# Altium project Stag12.PrjPcb (part 2 of 3)

## Sheet LOOM - HV BOX.SchDoc
size 297 x 209 mm
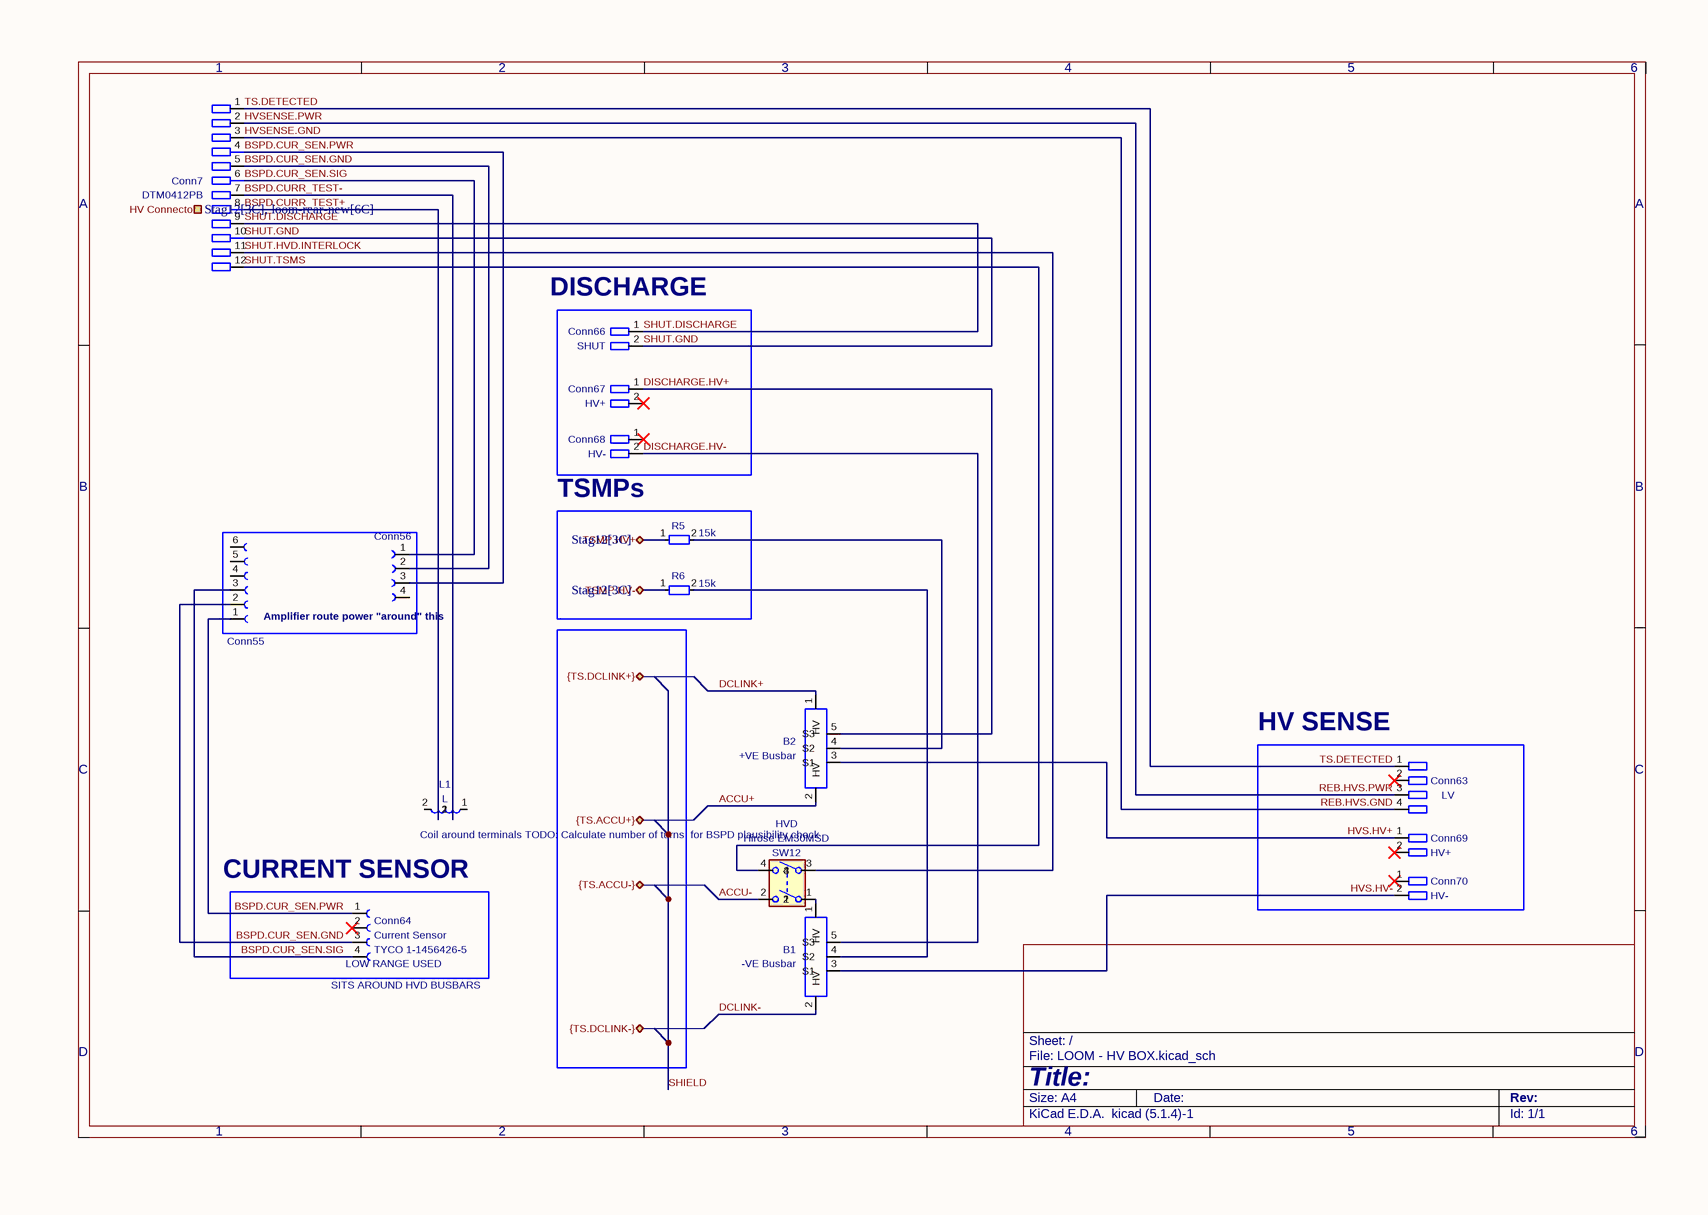
[diagram p23: LOOM - HV BOX.SchDoc]

### Parts
B1  -VE Busbar
B2  +VE Busbar
Conn7  P/N: DTM0412PB  (hidden comment: Deutsch_DTM_12P_Pin)
Conn55  Molex_3x2S_Recepticle  (value not drawn)
Conn56  Molex_2x2S_Recepticle  (value not drawn)
Conn63  Name: LV  (hidden comment: ~)
Conn64  P/N: TYCO 1-1456426-5  (hidden comment: Current Sensor)
Conn66  Name: SHUT  (hidden comment: Molex_2x1P_Horizontal_THT)
Conn67  Name: HV+  (hidden comment: Molex_2x1P_Horizontal_THT)
Conn68  Name: HV-  (hidden comment: Molex_2x1P_Horizontal_THT)
Conn69  Name: HV+  (hidden comment: Molex_2x1P_Horizontal_THT)
Conn70  Name: HV-  (hidden comment: Molex_2x1P_Horizontal_THT)
L1  L
R5  15k
R6  15k
SW12  Conn Name: HVD  (hidden comment: Hirose EM30MSD)

### Blocks framed on the sheet
Amplifier / route power "around" this: Conn55 Conn56
TSMPs: R5 R6
HV SENSE: Conn63 Conn69 Conn70
LOW RANGE USED: Conn64

### Ports
HV Connector (in, see Stag12[3C], loom-rear-new[6C]), TSMP.HV+ (bidir, see Stag12[3C]), TSMP.HV- (bidir, see Stag12[3C]), {TS.ACCU+} (bidir), {TS.ACCU-} (bidir), {TS.DCLINK+} (bidir), {TS.DCLINK-} (bidir)

### Nets
ACCU+: B2.2(HV)
ACCU-: SW12.2
BSPD.CUR_SEN.GND: Conn7.5 Conn55.2 Conn56.2 Conn64.3
BSPD.CUR_SEN.PWR: Conn7.4 Conn55.1 Conn56.3 Conn64.1
BSPD.CUR_SEN.SIG: Conn7.6 Conn55.3 Conn56.1 Conn64.4
BSPD.CURR_TEST+: Conn7.8
BSPD.CURR_TEST-: Conn7.7
DCLINK+: B2.1(HV)
DCLINK-: B1.2(HV)
DISCHARGE.HV+: B2.5(S3) Conn67.1
DISCHARGE.HV-: B1.5(S3) Conn68.2
HVS.HV+: B2.3(S1) Conn69.1
HVS.HV-: B1.3(S1) Conn70.2
HVSENSE.GND: Conn7.3 Conn63.4  [also labelled REB.HVS.GND]
HVSENSE.PWR: Conn7.2 Conn63.3  [also labelled REB.HVS.PWR]
SHUT.DISCHARGE: Conn7.9 Conn66.1
SHUT.GND: Conn7.10 Conn66.2
SHUT.HVD.INTERLOCK: Conn7.11 SW12.3
SHUT.TSMS: Conn7.12 SW12.4
TS.DETECTED: Conn7.1 Conn63.1
TSMP HV+: R5.1 ; port TSMP.HV+
TSMP HV-: R6.1 ; port TSMP.HV-
NetB1_1: B1.1(HV) SW12.1
NetB1_4: B1.4(S2) R6.2
NetB2_4: B2.4(S2) R5.2

Not connected (* = marked no-connect by the designer): Conn55 4 5 6; Conn56 4; Conn63 2*; Conn64 2*; Conn67 2*; Conn68 1*; Conn69 2*; Conn70 1*; L1 1 2

### Notes on the sheet
- (near Conn66) DISCHARGE
- Coil around terminals
  TODO: Calculate number of turns
  for BSPD plausibility check
- (near Conn64) CURRENT SENSOR
- (near Conn64) SITS AROUND HVD BUSBARS
- 1
- 2
- 3
- 4
- 5
- 6
- A
- B
- C
- D
- Title:
- File: LOOM - HV BOX.kicad_sch
- Sheet: /
- KiCad E.D.A.  kicad (5.1.4)-1
- Size: A4
- Date:
- Rev:
- Id: 1/1

### Library data of the parts
B1 B2 = Bus_Bar
  B1: Value: -VE Busbar
  B2: Value: +VE Busbar
Conn55 = Molex_3x2S_Recepticle: P/N: 43025-0600; Value: Molex_3x2S_Recepticle
Conn56 = Molex_2x2S_Recepticle: P/N: 43025-0400; Value: Molex_2x2S_Recepticle
Conn63 = Molex_2x2P_Horizontal_1: P/N: 43045-0400; Value: ~
Conn64 = Current Sensor Connector: Value: Current Sensor
Conn66-Conn70 = Molex_2x1P_Horizontal_THT: P/N: 43650-0200; Value: Molex_2x1P_Horizontal_THT
R5 R6 = R_Small: Value: 15k
SW12 = SW_DPST: Value: Hirose EM30MSD
Conn7 = Deutsch_DTM_12P_Pin: Value: Deutsch_DTM_12P_Pin
L1 = L: Value: L

## Sheet device-bps.SchDoc
size 297 x 209 mm
Used 2 times, as channels DEVICE - BPS - FRONT, DEVICE - BPS - REAR. Parts and nets are listed once, with the designators drawn on the sheet.
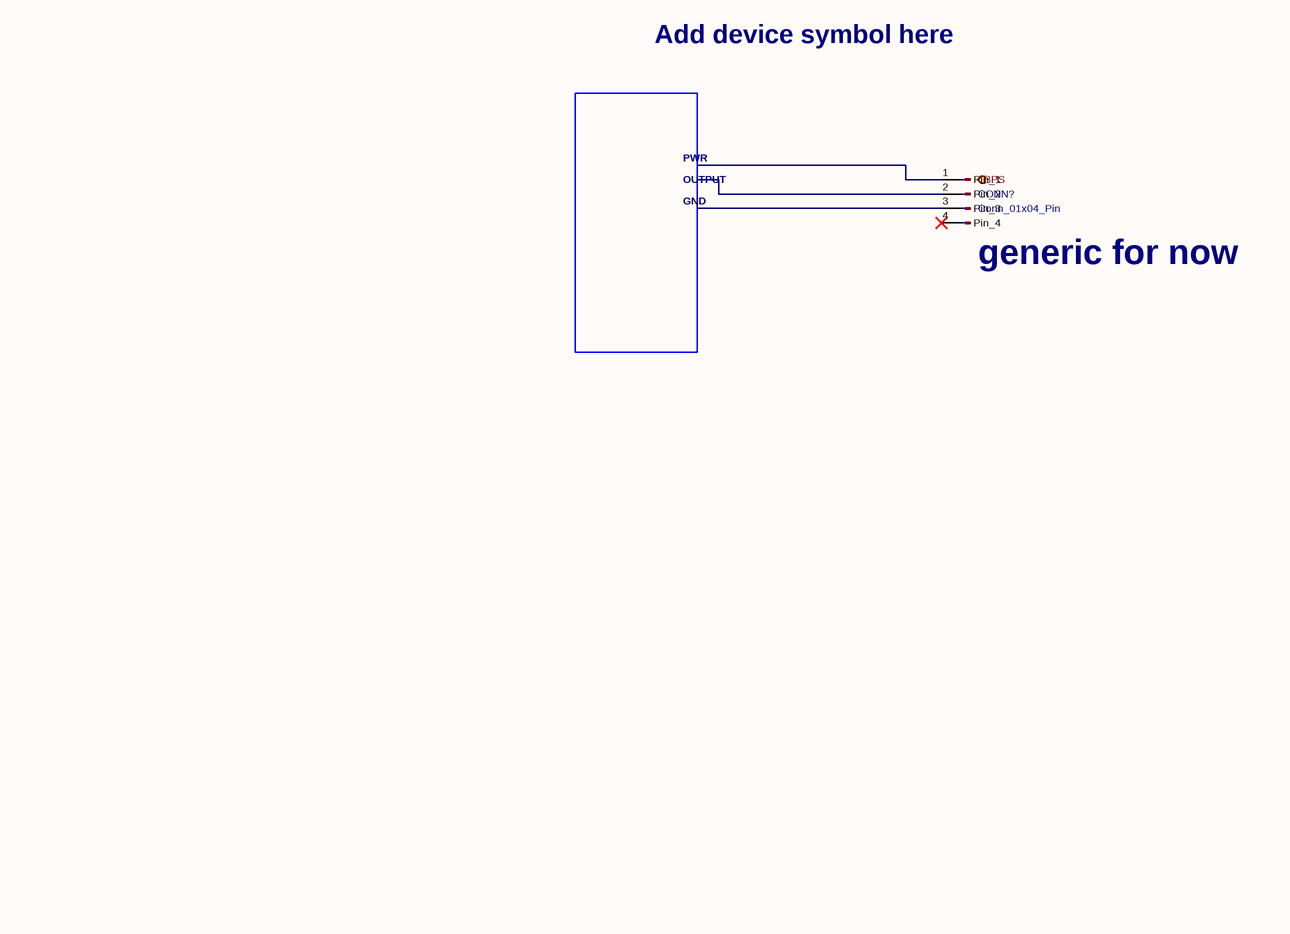
[diagram p24: device-bps.SchDoc]

### Parts
CONN?  Conn_01x04_Pin

### Ports
BPS (out)

### Nets

Not connected (* = marked no-connect by the designer): CONN? 1(Pin_1) 2(Pin_2) 3(Pin_3) 4(Pin_4)*

### Channels
DEVICE - BPS - FRONT: designators end in _DEVICE_-_BPS_-_FRONT; ports BPS=BPS_DEVICE - BPS - FRONT
DEVICE - BPS - REAR: designators end in _DEVICE_-_BPS_-_REAR; ports BPS=BPS_DEVICE - BPS - REAR

### Notes on the sheet
- Add device symbol here
- GND
- PWR
- OUTPUT
- (near CONN?) generic for now
- 1
- 2
- 3
- 4
- 5
- 6
- A
- B
- C
- D
- Title: DEVICE - BPS
- File: device-bps.kicad_sch
- Sheet: /
- KiCad E.D.A.  kicad (5.1.4)-1
- Size: A4
- Date:
- Rev:
- Id: 1/1

### Library data of the parts
CONN? = Conn_01x04_Pin: Value: Conn_01x04_Pin

## Sheet loom-front-box.SchDoc
size 840 x 594 mm
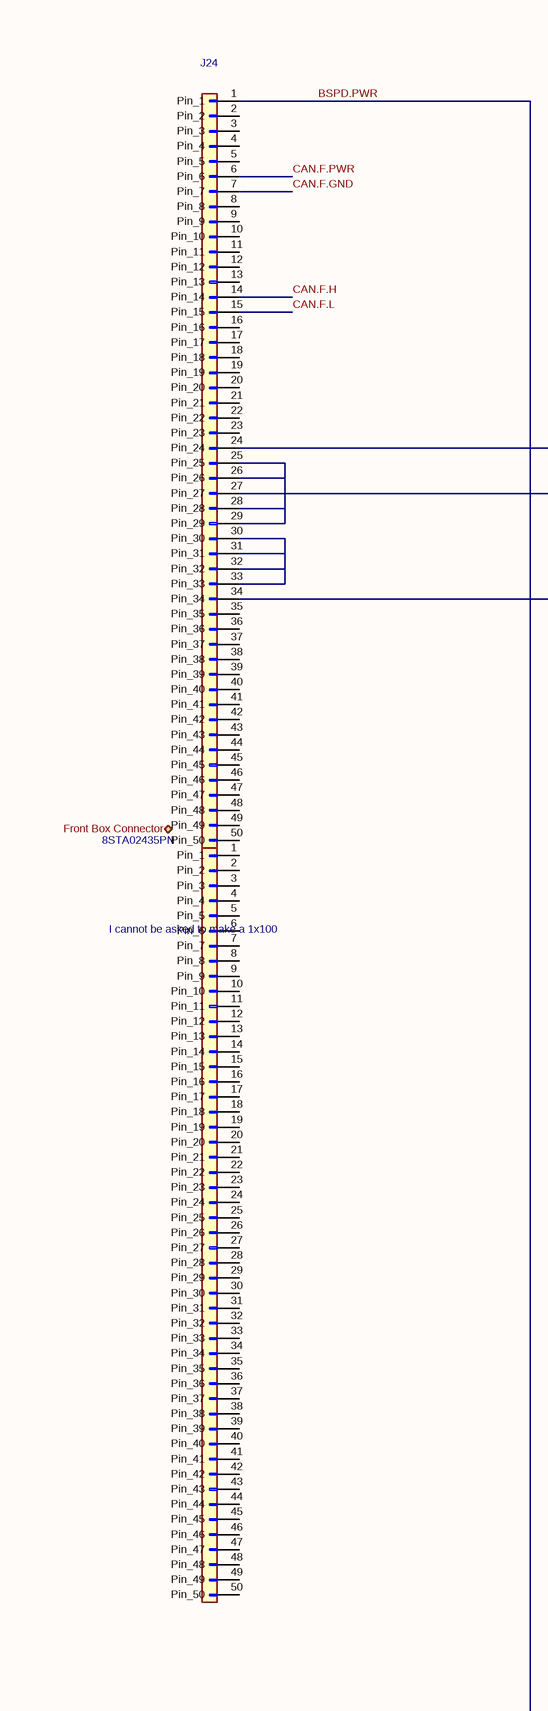
[diagram p25: loom-front-box.SchDoc, top middle]
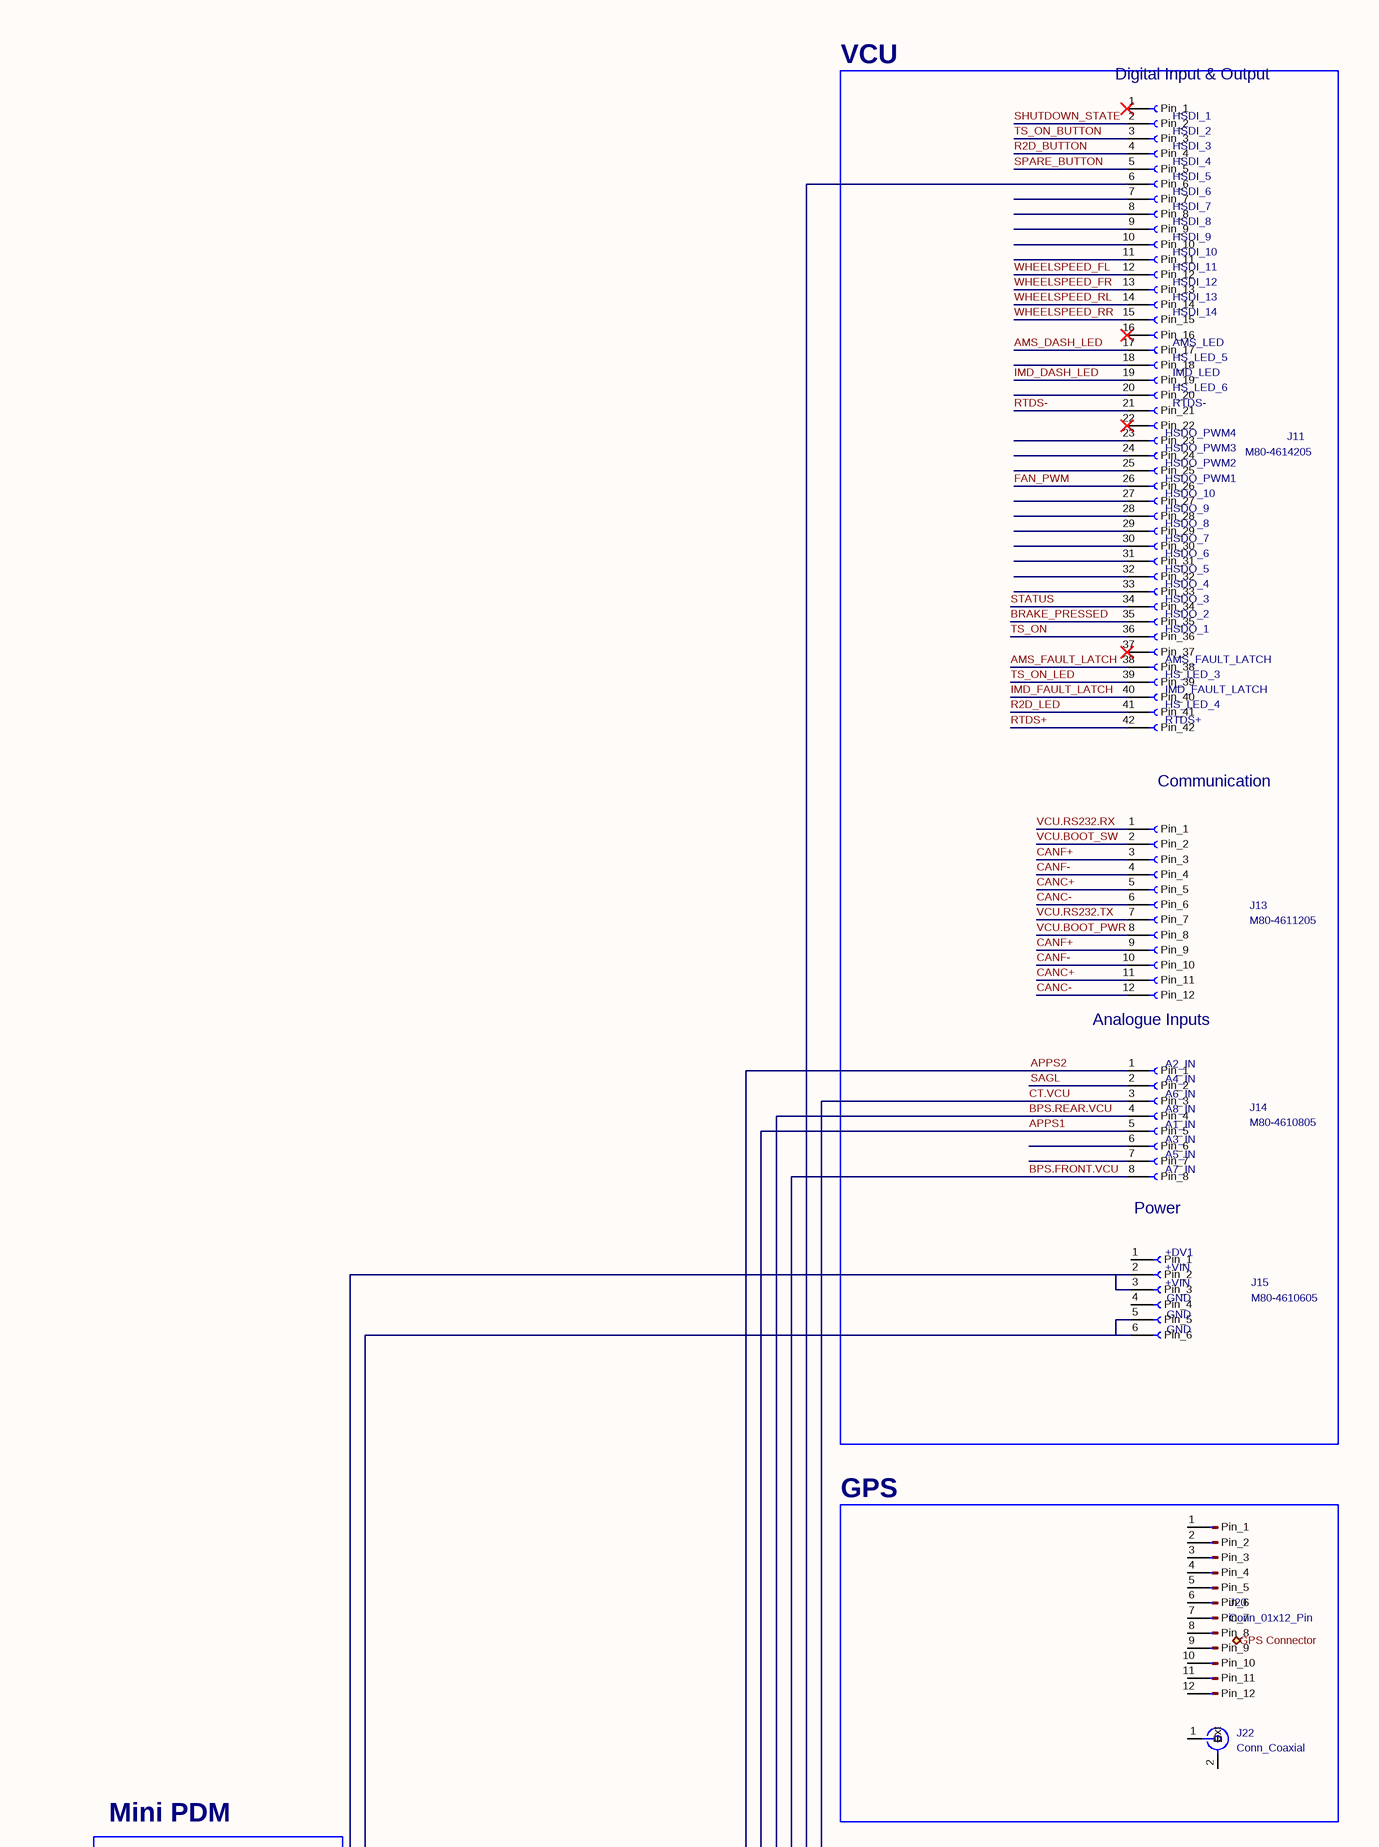
[diagram p26: loom-front-box.SchDoc, top right]
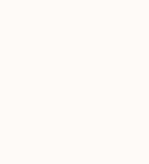
[diagram p27: loom-front-box.SchDoc, bottom left]
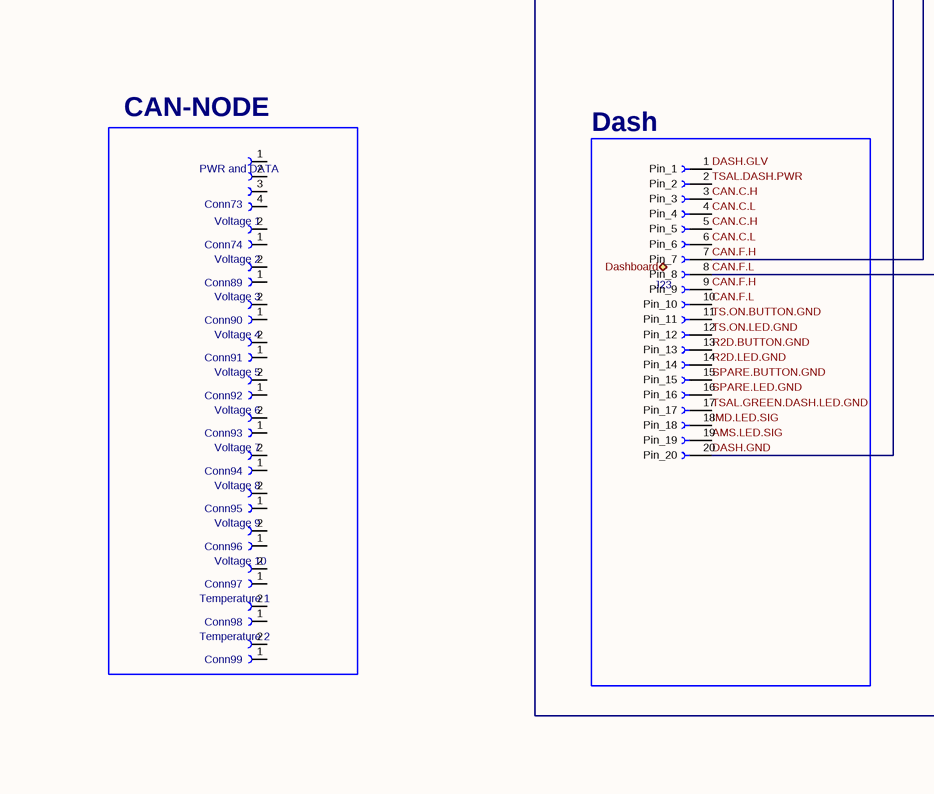
[diagram p28: loom-front-box.SchDoc, bottom middle]
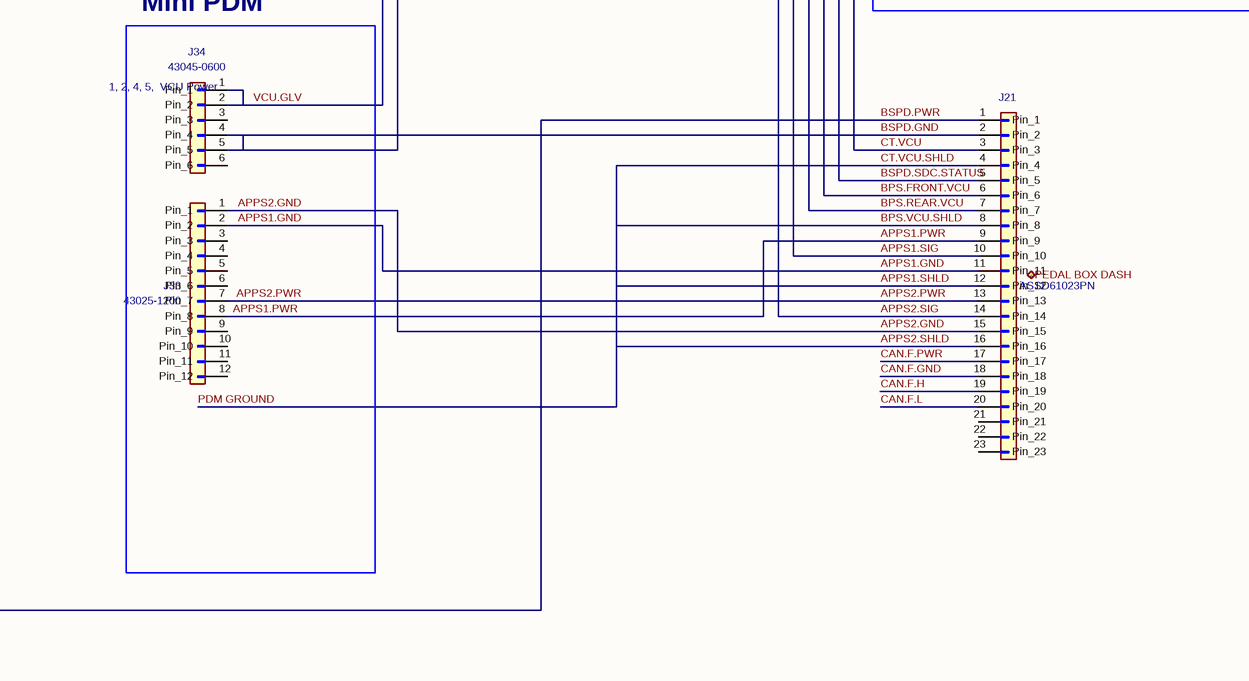
[diagram p29: loom-front-box.SchDoc, bottom right]

### Parts
(Parts that share a designator on the sheet are numbered #1, #2 ... from top to bottom, then left to right.)
Conn73  Molex_4x1S_Recepticle  (value not drawn)
Conn74#1  Molex_2x1S_Recepticle  (value not drawn)
Conn89#2  Molex_2x1S_Recepticle  (value not drawn)
Conn90#2  Molex_2x1S_Recepticle  (value not drawn)
Conn91  Molex_2x1S_Recepticle  (value not drawn)
Conn92  Molex_2x1S_Recepticle  (value not drawn)
Conn93  Molex_2x1S_Recepticle  (value not drawn)
Conn94  Molex_2x1S_Recepticle  (value not drawn)
Conn95  Molex_2x1S_Recepticle  (value not drawn)
Conn96  Molex_2x1S_Recepticle  (value not drawn)
Conn97  Molex_2x1S_Recepticle  (value not drawn)
Conn98  Molex_2x1S_Recepticle  (value not drawn)
Conn99  Molex_2x1S_Recepticle  (value not drawn)
J11  M80-4614205
J13  M80-4611205
J14  M80-4610805
J15  M80-4610605
J20  Conn_01x12_Pin
J21  ASSD61023PN
J22  Conn_Coaxial
J23  Conn_01x20_Socket  (value not drawn)
J24  8STA02435PN
J25  8STA02435PN  (value not drawn)
J33  43025-1200  [Molex_Micro-Fit_3.0_43045-1200_2x06_P3.00mm_Horizontal]
J34  43045-0600  [Molex_Micro-Fit_3.0_43045-0600_2x03_P3.00mm_Horizontal]

### Blocks framed on the sheet
VCU: J11 J13-J15
GPS: J20 J22
CAN-NODE /: Conn73 Conn74#1 Conn89#2 Conn90#2 Conn91-Conn99
Dash: J23
Mini PDM: J33 J34

### Ports
Dashboard (bidir), Front Box Connector (bidir), GPS Connector (bidir), PEDAL BOX DASH (bidir)

### Nets
AMS.LED.SIG: J23.19(Pin_19)
AMS_DASH_LED: J11.17(Pin_17)
AMS_FAULT_LATCH: J11.38(Pin_38)
APPS1: J14.5(Pin_5) J21.10(Pin_10)  [also labelled APPS1.SIG]
APPS1.GND: J21.11(Pin_11) J33.2(Pin_2)
APPS1.PWR: J21.9(Pin_9) J33.8(Pin_8)
APPS1.SHLD: J21.4(Pin_4) J21.8(Pin_8) J21.12(Pin_12) J21.16(Pin_16)  [also labelled APPS2.SHLD, BPS.VCU.SHLD, CT.VCU.SHLD, PDM GROUND]
APPS2: J14.1(Pin_1) J21.14(Pin_14)  [also labelled APPS2.SIG]
APPS2.GND: J21.15(Pin_15) J33.1(Pin_1)
APPS2.PWR: J21.13(Pin_13) J33.7(Pin_7)
BPS.FRONT.VCU: J14.8(Pin_8) J21.6(Pin_6)
BPS.REAR.VCU: J14.4(Pin_4) J21.7(Pin_7)
BRAKE_PRESSED: J11.35(Pin_35)
BSPD.GND: J15.5(Pin_5) J15.6(Pin_6) J21.2(Pin_2) J34.4(Pin_4) J34.5(Pin_5)
BSPD.PWR: J21.1(Pin_1) J24.1(Pin_1)
BSPD.SDC.STATUS: J11.6(Pin_6) J21.5(Pin_5)
CAN.C.H: J23.3(Pin_3) J23.5(Pin_5)
CAN.C.L: J23.4(Pin_4) J23.6(Pin_6)
CAN.F.GND: J21.18(Pin_18) J24.7(Pin_7)
CAN.F.H: J21.19(Pin_19) J23.7(Pin_7) J23.9(Pin_9) J24.14(Pin_14) J24.24(Pin_24)
CAN.F.L: J21.20(Pin_20) J23.8(Pin_8) J23.10(Pin_10) J24.15(Pin_15) J24.34(Pin_34)
CAN.F.PWR: J21.17(Pin_17) J24.6(Pin_6)
CANC+: J13.5(Pin_5) J13.11(Pin_11)
CANC-: J13.6(Pin_6) J13.12(Pin_12)
CANF+: J13.3(Pin_3) J13.9(Pin_9)
CANF-: J13.4(Pin_4) J13.10(Pin_10)
CT.VCU: J14.3(Pin_3) J21.3(Pin_3)
DASH.GLV: J23.1(Pin_1)
DASH.GND: J23.20(Pin_20) J24.25(Pin_25) J24.26(Pin_26) J24.27(Pin_27) J24.28(Pin_28) J24.29(Pin_29)
FAN_PWM: J11.26(Pin_26)
IMD.LED.SIG: J23.18(Pin_18)
IMD_DASH_LED: J11.19(Pin_19)
IMD_FAULT_LATCH: J11.40(Pin_40)
R2D.BUTTON.GND: J23.13(Pin_13)
R2D.LED.GND: J23.14(Pin_14)
R2D_BUTTON: J11.4(Pin_4)
R2D_LED: J11.41(Pin_41)
RTDS+: J11.42(Pin_42)
RTDS-: J11.21(Pin_21)
SAGL: J14.2(Pin_2)
SHUTDOWN_STATE: J11.2(Pin_2)
SPARE.BUTTON.GND: J23.15(Pin_15)
SPARE.LED.GND: J23.16(Pin_16)
SPARE_BUTTON: J11.5(Pin_5)
STATUS: J11.34(Pin_34)
TS.ON.BUTTON.GND: J23.11(Pin_11)
TS.ON.LED.GND: J23.12(Pin_12)
TS_ON: J11.36(Pin_36)
TS_ON_BUTTON: J11.3(Pin_3)
TS_ON_LED: J11.39(Pin_39)
TSAL.DASH.PWR: J23.2(Pin_2)
TSAL.GREEN.DASH.LED.GND: J23.17(Pin_17)
VCU.BOOT_PWR: J13.8(Pin_8)
VCU.BOOT_SW: J13.2(Pin_2)
VCU.GLV: J15.2(Pin_2) J15.3(Pin_3) J34.1(Pin_1) J34.2(Pin_2)
VCU.RS232.RX: J13.1(Pin_1)
VCU.RS232.TX: J13.7(Pin_7)
WHEELSPEED_FL: J11.12(Pin_12)
WHEELSPEED_FR: J11.13(Pin_13)
WHEELSPEED_RL: J11.14(Pin_14)
WHEELSPEED_RR: J11.15(Pin_15)
NetJ24_30: J24.30(Pin_30) J24.31(Pin_31) J24.32(Pin_32) J24.33(Pin_33)

Not connected (* = marked no-connect by the designer): Conn73 1 2 3 4; Conn74#1 1 2; Conn89#2 1 2; Conn90#2 1 2; Conn91 1 2; Conn92 1 2; Conn93 1 2; Conn94 1 2; Conn95 1 2; Conn96 1 2; Conn97 1 2; Conn98 1 2; Conn99 1 2; J11 1(Pin_1)* 7(Pin_7) 8(Pin_8) 9(Pin_9) 10(Pin_10) 11(Pin_11) 16(Pin_16)* 18(Pin_18) 20(Pin_20) 22(Pin_22)* 23(Pin_23) 24(Pin_24) 25(Pin_25) 27(Pin_27) 28(Pin_28) 29(Pin_29) 30(Pin_30) 31(Pin_31) 32(Pin_32) 33(Pin_33) 37(Pin_37)*; J14 6(Pin_6) 7(Pin_7); J15 1(Pin_1) 4(Pin_4); J20 1(Pin_1) 2(Pin_2) 3(Pin_3) 4(Pin_4) 5(Pin_5) 6(Pin_6) 7(Pin_7) 8(Pin_8) 9(Pin_9) 10(Pin_10) 11(Pin_11) 12(Pin_12); J21 21(Pin_21) 22(Pin_22) 23(Pin_23); J22 1(In) 2(Ext); J24 2(Pin_2) 3(Pin_3) 4(Pin_4) 5(Pin_5) 8(Pin_8) 9(Pin_9) 10(Pin_10) 11(Pin_11) 12(Pin_12) 13(Pin_13) 16(Pin_16) 17(Pin_17) 18(Pin_18) 19(Pin_19) 20(Pin_20) 21(Pin_21) 22(Pin_22) 23(Pin_23) 35(Pin_35) 36(Pin_36) 37(Pin_37) 38(Pin_38) 39(Pin_39) 40(Pin_40) 41(Pin_41) 42(Pin_42) 43(Pin_43) 44(Pin_44) 45(Pin_45) 46(Pin_46) 47(Pin_47) 48(Pin_48) 49(Pin_49) 50(Pin_50); J25 1(Pin_1) 2(Pin_2) 3(Pin_3) 4(Pin_4) 5(Pin_5) 6(Pin_6) 7(Pin_7) 8(Pin_8) 9(Pin_9) 10(Pin_10) 11(Pin_11) 12(Pin_12) 13(Pin_13) 14(Pin_14) 15(Pin_15) 16(Pin_16) 17(Pin_17) 18(Pin_18) 19(Pin_19) 20(Pin_20) 21(Pin_21) 22(Pin_22) 23(Pin_23) 24(Pin_24) 25(Pin_25) 26(Pin_26) 27(Pin_27) 28(Pin_28) 29(Pin_29) 30(Pin_30) 31(Pin_31) 32(Pin_32) 33(Pin_33) 34(Pin_34) 35(Pin_35) 36(Pin_36) 37(Pin_37) 38(Pin_38) 39(Pin_39) 40(Pin_40) 41(Pin_41) 42(Pin_42) 43(Pin_43) 44(Pin_44) 45(Pin_45) 46(Pin_46) 47(Pin_47) 48(Pin_48) 49(Pin_49) 50(Pin_50); J33 3(Pin_3) 4(Pin_4) 5(Pin_5) 6(Pin_6) 9(Pin_9) 10(Pin_10) 11(Pin_11) 12(Pin_12); J34 3(Pin_3) 6(Pin_6)

### Notes on the sheet
- (near J11) Digital Input & Output
- (near J11) HSDI_4
- (near J11) HSDI_3
- (near J11) HSDI_2
- (near J11) HSDI_1
- (near J11) HSDI_8
- (near J11) HSDI_5
- (near J11) HSDI_6
- (near J11) HSDI_7
- (near J11) HSDI_9
- (near J11) HSDI_13
- (near J11) HSDI_14
- (near J11) HSDI_10
- (near J11) HSDI_11
- (near J11) HSDI_12
- (near J11) IMD_LED
- (near J11) HS_LED_6
- (near J11) AMS_LED
- (near J11) HS_LED_5
- (near J11) HSDO_PWM4
- (near J11) HSDO_PWM3
- (near J11) HSDO_PWM2
- (near J11) RTDS-
- (near J11) HSDO_PWM1
- (near J11) HSDO_8
- (near J11) HSDO_7
- (near J11) HSDO_9
- (near J11) HSDO_10
- (near J11) HSDO_5
- (near J11) HSDO_4
- (near J11) HSDO_2
- (near J11) HSDO_6
- (near J11) HSDO_3
- (near J11) AMS_FAULT_LATCH
- (near J11) HS_LED_3
- (near J11) HSDO_1
- (near J11) IMD_FAULT_LATCH
- (near J11) HS_LED_4
- (near J11) RTDS+
- Communication
- (near J25) I cannot be asked
  to make a 1x100
- (near J13) Analogue Inputs
- (near J14) A2_IN
- (near J14) A4_IN
- (near J14) A1_IN
- (near J14) A6_IN
- (near J14) A3_IN
- (near J14) A8_IN
- Power
- (near J14) A5_IN
- (near J14) A7_IN
- (near J15) +VIN
- (near J15) +DV1
- (near J15) GND
- (near Conn73) PWR and DATA
- (near J34) 1, 2,
  4, 5,
  VCU Power
- (near Conn74#1) Voltage 1
- (near Conn89#2) Voltage 2
- (near Conn90#2) Voltage 3
- (near Conn91) Voltage 4
- (near Conn92) Voltage 5
- (near Conn93) Voltage 6
- (near Conn94) Voltage 7
- (near Conn95) Voltage 8
- (near Conn97) Voltage 10
- (near Conn96) Voltage 9
- (near Conn98) Temperature 1
- (near Conn99) Temperature 2
- 1
- 2
- 3
- 4
- 5
- 6
- 7
- 8
- 9
- 10
- 11
- 12
- 13
- 14
- 15
- 16
- A
- B
- C
- D
- E
- F
- G
- H
- I
- J
- K
- Title: Front Box
- File: loom-front-box.kicad_sch
- Sheet: /
- KiCad E.D.A.  kicad (5.1.4)-1
- Size: A1
- Date:
- Rev:
- Id: 1/1

### Library data of the parts
Conn73 = Molex_4x1S_Recepticle: P/N: 43645-0400; Value: Molex_4x1S_Recepticle
Conn74#1 Conn89#2 Conn90#2 Conn91-Conn99 = Molex_2x1S_Recepticle: P/N: 43645-0200; Value: Molex_2x1S_Recepticle
J11 = Conn_01x42_Socket: Description: "Generic connector, single row, 01x42, script generated"; Value: M80-4614205
J13 = Conn_01x12_Socket: Description: Generic connector, single row, 01x12, script generated; Value: M80-4611205
J14 = Conn_01x08_Socket: Description: Generic connector, single row, 01x08, script generated; Value: M80-4610805
J15 = Conn_01x06_Socket: Description: Generic connector, single row, 01x06, script generated; Value: M80-4610605
J20 = Conn_01x12_Pin: Description: Generic connector, single row, 01x12, script generated; Value: Conn_01x12_Pin
J21 = Conn_01x23: Description: Generic connector, single row, 01x23, script generated (kicad-library-utils/schlib/autogen/connector/); Value: ASSD61023PN
J22 = Conn_Coaxial: Description: coaxial connector (BNC, SMA, SMB, SMC, Cinch/RCA, LEMO, ...); Value: Conn_Coaxial
J23 = Conn_01x20_Socket: Description: Generic connector, single row, 01x20, script generated; Value: Conn_01x20_Socket
J24 J25 = Conn_01x50: Description: "Generic connector, single row, 01x50, script generated"; Value: 8STA02435PN
J33 = Conn_01x12: Description: Generic connector, single row, 01x12, script generated (kicad-library-utils/schlib/autogen/connector/); To Order: INV; Value: 43025-1200; Footprint: Connector_Molex:Molex_Micro-Fit_3.0_43045-1200_2x06_P3.00mm_Horizontal
J34 = Conn_01x06: Description: Generic connector, single row, 01x06, script generated (kicad-library-utils/schlib/autogen/connector/); To Order: INV; Value: 43045-0600; Footprint: Connector_Molex:Molex_Micro-Fit_3.0_43045-0600_2x03_P3.00mm_Horizontal

## Sheet loom-side-panel-right.SchDoc
size 297 x 209 mm
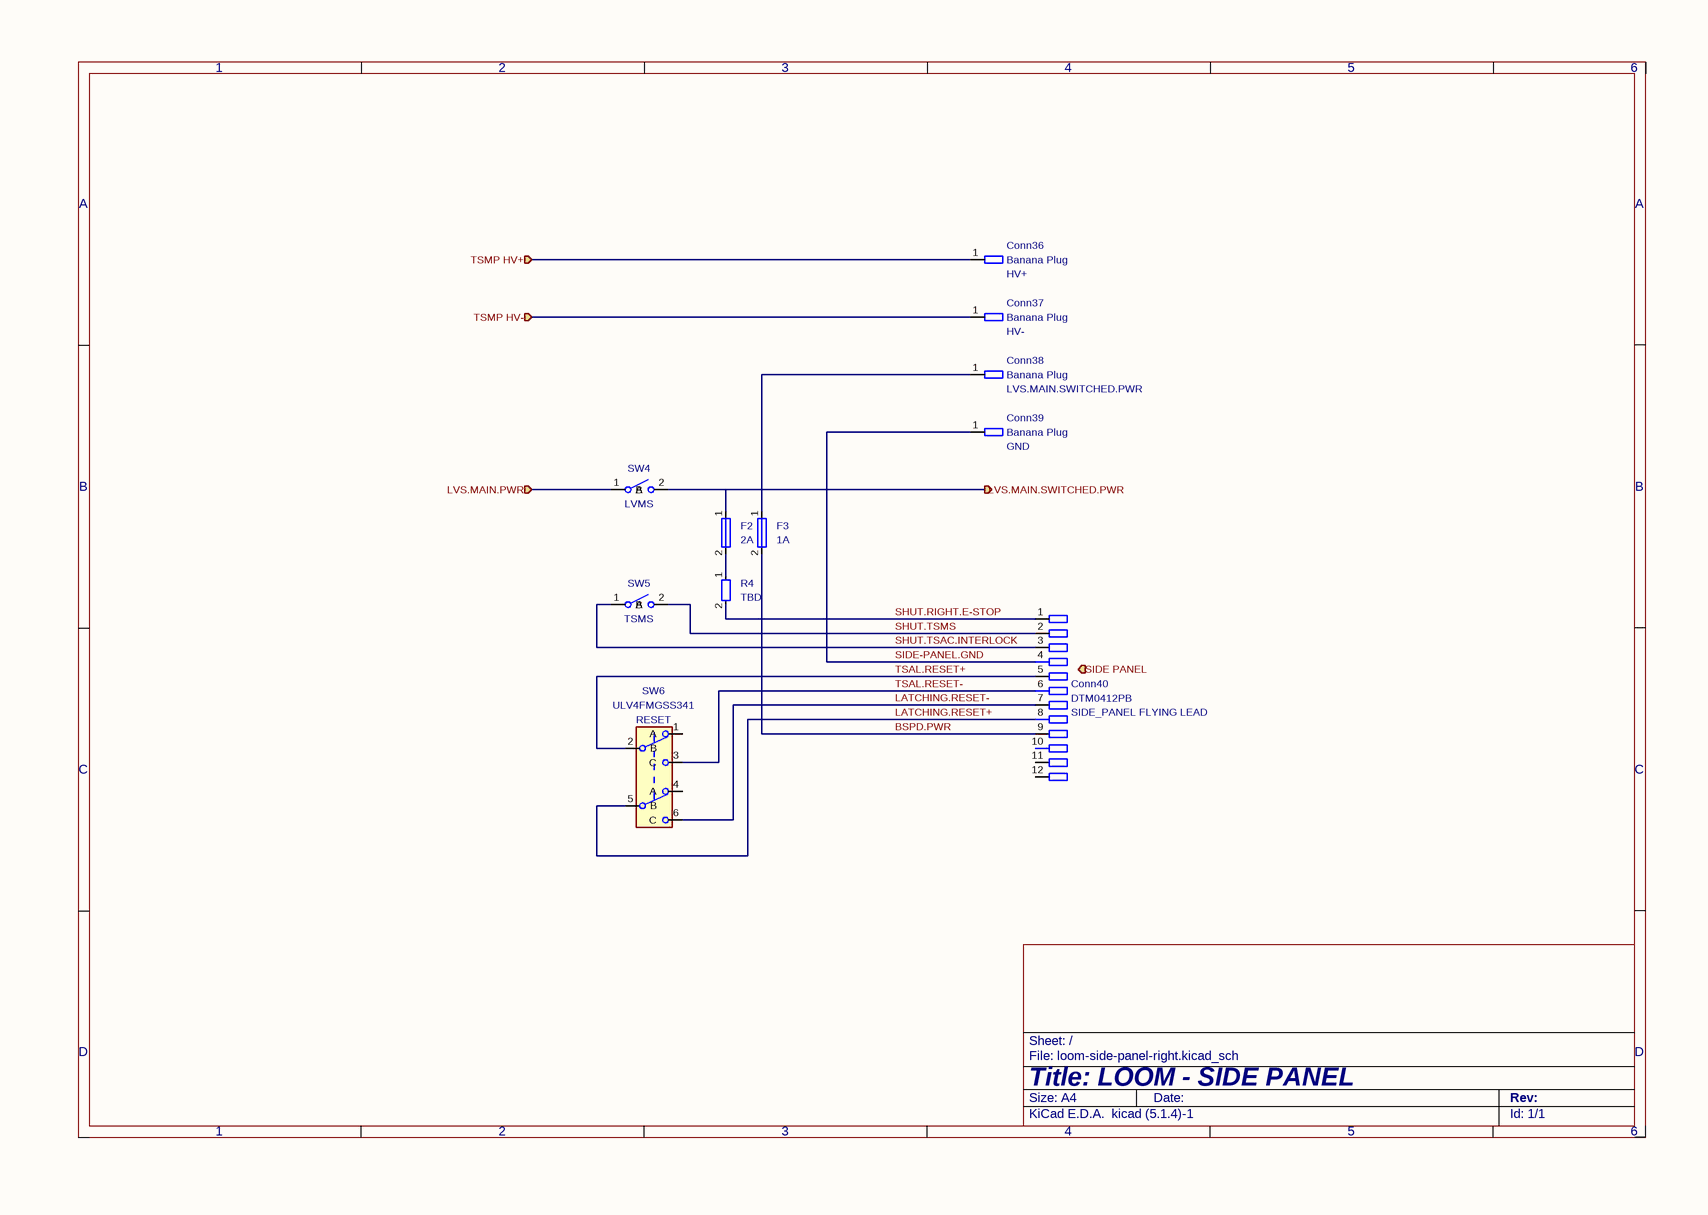
[diagram p30: loom-side-panel-right.SchDoc]

### Parts
(Parts that share a designator on the sheet are numbered #1, #2 ... from top to bottom, then left to right.)
Conn36#1  Connection Type: HV+  (hidden comment: Banana Plug)
Conn37#1  Connection Type: HV-  (hidden comment: Banana Plug)
Conn38#1  Connection Type: LVS.MAIN.SWITCHED.PWR  (hidden comment: Banana Plug)
Conn39#1  Connection Type: GND  (hidden comment: Banana Plug)
Conn40#1  P/N: DTM0412PB  Conn Name: SIDE_PANEL FLYING LEAD  (hidden comment: Deutsch_DTM_12P_Pin)
F2  2A
F3  1A
R4#1  TBD
SW4#1  LVMS
SW5#1  TSMS
SW6#1  Conn Name: RESET  (hidden comment: ULV4FMGSS341)

### Ports
LVS.MAIN.PWR (in), LVS.MAIN.SWITCHED.PWR (out), SIDE PANEL (in), TSMP HV+ (in), TSMP HV- (in)

### Nets
BSPD.PWR: Conn40#1.9 F3.2
GLV.LVMS+: SW4#1.1(A) ; port LVS.MAIN.PWR
LATCHING.RESET+: Conn40#1.8 SW6#1.5(B)
LATCHING.RESET-: Conn40#1.7 SW6#1.6(C)
LVS.MAIN.SWITCHED.EXC: Conn38#1.1 F2.1 F3.1 SW4#1.2(B) ; port LVS.MAIN.SWITCHED.PWR
SHUT.RIGHT.E-STOP: Conn40#1.1 R4#1.2
SHUT.TSAC.INTERLOCK: Conn40#1.3 SW5#1.1(A)
SHUT.TSMS: Conn40#1.2 SW5#1.2(B)
SIDE-PANEL.GND: Conn39#1.1 Conn40#1.4
TSAL.RESET+: Conn40#1.5 SW6#1.2(B)
TSAL.RESET-: Conn40#1.6 SW6#1.3(C)
TSMP HV+: Conn36#1.1 ; port TSMP HV+
TSMP HV-: Conn37#1.1 ; port TSMP HV-
NetF2_2: F2.2 R4#1.1

Not connected (* = marked no-connect by the designer): Conn40#1 10 11 12; SW6#1 1(A) 4(A)

### Notes on the sheet
- 1
- 2
- 3
- 4
- 5
- 6
- A
- B
- C
- D
- Title: LOOM - SIDE PANEL
- File: loom-side-panel-right.kicad_sch
- Sheet: /
- KiCad E.D.A.  kicad (5.1.4)-1
- Size: A4
- Date:
- Rev:
- Id: 1/1

### Library data of the parts
F2 F3 = Fuse
  F2: Value: 2A
  F3: Value: 1A
R4#1 = R_Small: Value: TBD
SW4#1 SW5#1 = SW_SPST
  SW4#1: Value: LVMS
  SW5#1: Value: TSMS
SW6#1 = SW_Push_DPDT: Value: ULV4FMGSS341
Conn36#1 Conn37#1 Conn38#1 Conn39#1 = Banana Plug: Value: Banana Plug
Conn40#1 = Deutsch_DTM_12P_Pin: Value: Deutsch_DTM_12P_Pin

## Sheet device-bspd.SchDoc
size 297 x 209 mm
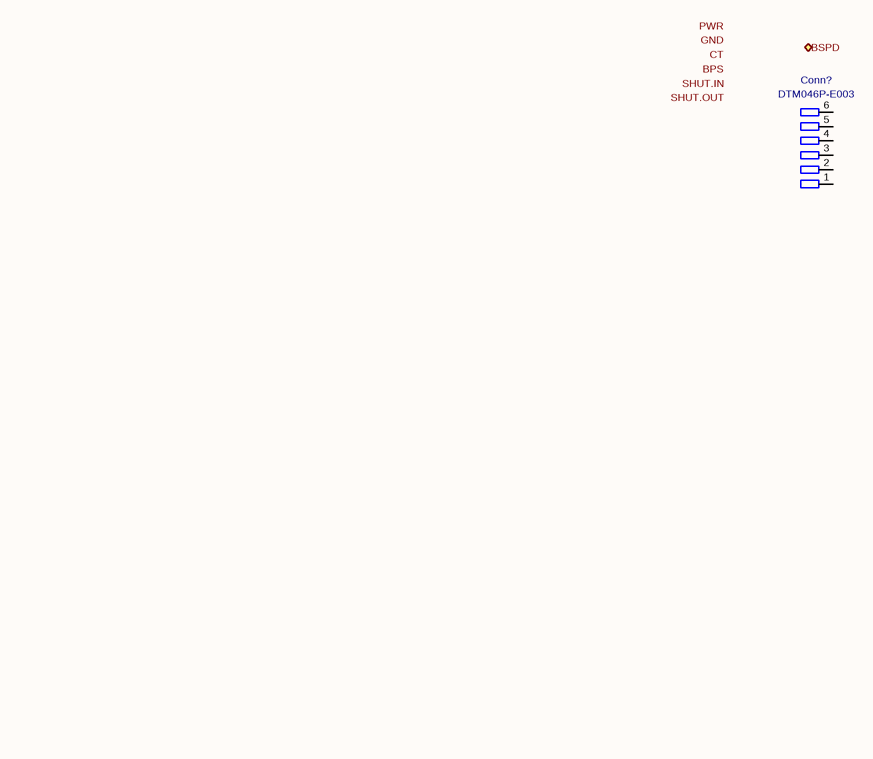
[diagram p31: device-bspd.SchDoc]

### Parts
(Parts that share a designator on the sheet are numbered #1, #2 ... from top to bottom, then left to right.)
Conn?#10  P/N: DTM046P-E003  (hidden comment: Deutsch_DTM_6P_Pin)

### Ports
BSPD (bidir)

### Nets

Not connected (* = marked no-connect by the designer): Conn?#10 1 2 3 4 5 6

### Notes on the sheet
- Labels drawn without touching a wire or pin: BPS, CT, GND, PWR, SHUT.IN, SHUT.OUT
- 1
- 2
- 3
- 4
- 5
- 6
- A
- B
- C
- D
- Title: DEVICE - BSPD
- File: device-bspd.kicad_sch
- Sheet: /
- KiCad E.D.A.  kicad (5.1.4)-1
- Size: A4
- Date:
- Rev:
- Id: 1/1

### Library data of the parts
Conn?#10 = Deutsch_DTM_6P_Pin: Value: Deutsch_DTM_6P_Pin

## Sheet device-ground-box.SchDoc
size 297 x 209 mm
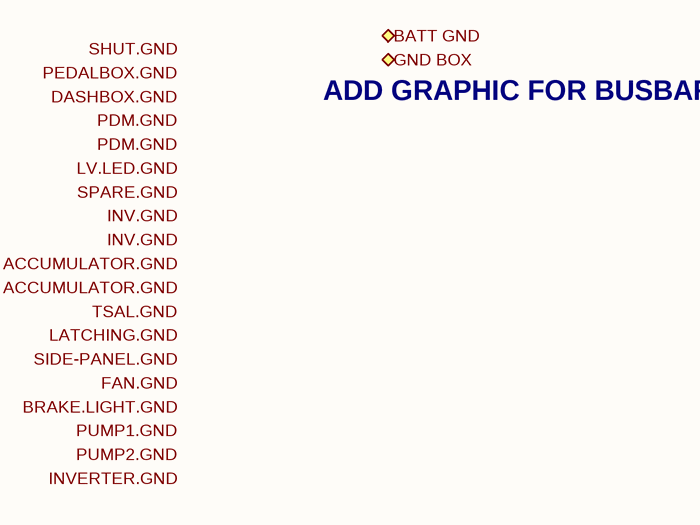
[diagram p32: device-ground-box.SchDoc]

### Ports
BATT GND (bidir), GND BOX (bidir)

### Notes on the sheet
- ADD GRAPHIC FOR BUSBAR
- Labels drawn without touching a wire or pin: ACCUMULATOR.GND, BRAKE.LIGHT.GND, DASHBOX.GND, FAN.GND, INV.GND, INVERTER.GND, LATCHING.GND, LV.LED.GND, PDM.GND, PEDALBOX.GND, PUMP1.GND, PUMP2.GND, SHUT.GND, SIDE-PANEL.GND, SPARE.GND, TSAL.GND
- 1
- 2
- 3
- 4
- 5
- 6
- A
- B
- C
- D
- Title: DEVICE - GROUND BOX
- File: device-ground-box.kicad_sch
- Sheet: /
- KiCad E.D.A.  kicad (5.1.4)-1
- Size: A4
- Date:
- Rev:
- Id: 1/1

## Sheet device-motor.SchDoc
size 297 x 209 mm
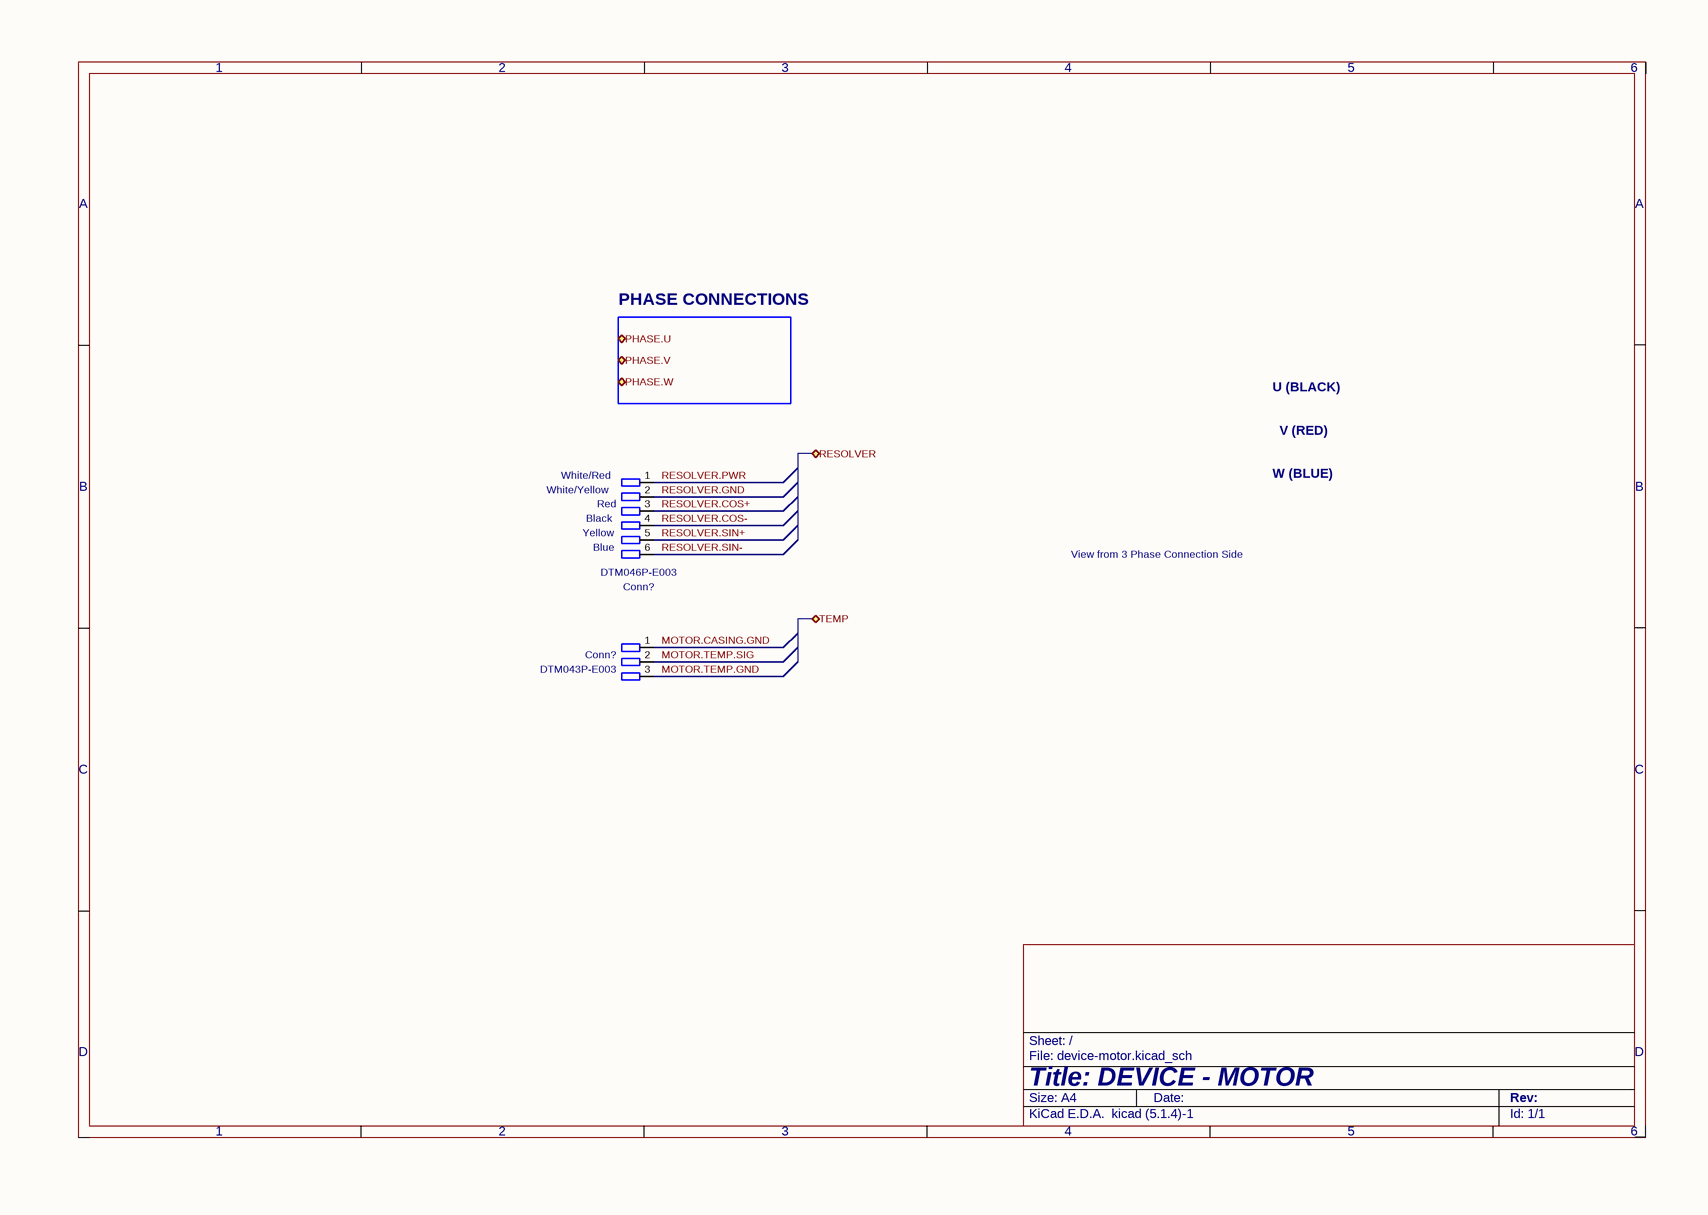
[diagram p33: device-motor.SchDoc]

### Parts
(Parts that share a designator on the sheet are numbered #1, #2 ... from top to bottom, then left to right.)
Conn?#11  P/N: DTM046P-E003  (hidden comment: Deutsch_DTM_6P_Pin)
Conn?#12  P/N: DTM043P-E003  (hidden comment: Deutsch_DTM_2P_Pin)

### Ports
PHASE.U (bidir), PHASE.V (bidir), PHASE.W (bidir), RESOLVER (bidir), TEMP (bidir)

### Nets
MOTOR.CASING.GND: Conn?#12.1
MOTOR.TEMP.GND: Conn?#12.3
MOTOR.TEMP.SIG: Conn?#12.2
RESOLVER.COS+: Conn?#11.3
RESOLVER.COS-: Conn?#11.4
RESOLVER.GND: Conn?#11.2
RESOLVER.PWR: Conn?#11.1
RESOLVER.SIN+: Conn?#11.5
RESOLVER.SIN-: Conn?#11.6

### Notes on the sheet
- PHASE CONNECTIONS
- U (BLACK)
- (near Conn?#11) White/Yellow
- (near Conn?#11) White/Red
- (near Conn?#11) Red
- W (BLUE)
- V (RED)
- (near Conn?#11) Yellow
- (near Conn?#11) Black
- (near Conn?#11) Blue
- View from 3 Phase Connection Side
- 1
- 2
- 3
- 4
- 5
- 6
- A
- B
- C
- D
- Title: DEVICE - MOTOR
- File: device-motor.kicad_sch
- Sheet: /
- KiCad E.D.A.  kicad (5.1.4)-1
- Size: A4
- Date:
- Rev:
- Id: 1/1

### Library data of the parts
Conn?#12 = Deutsch_DTM_3P_Pin: Value: Deutsch_DTM_2P_Pin
Conn?#11 = Deutsch_DTM_6P_Pin: Value: Deutsch_DTM_6P_Pin

## Sheet loom-rear-new.SchDoc
size 840 x 594 mm
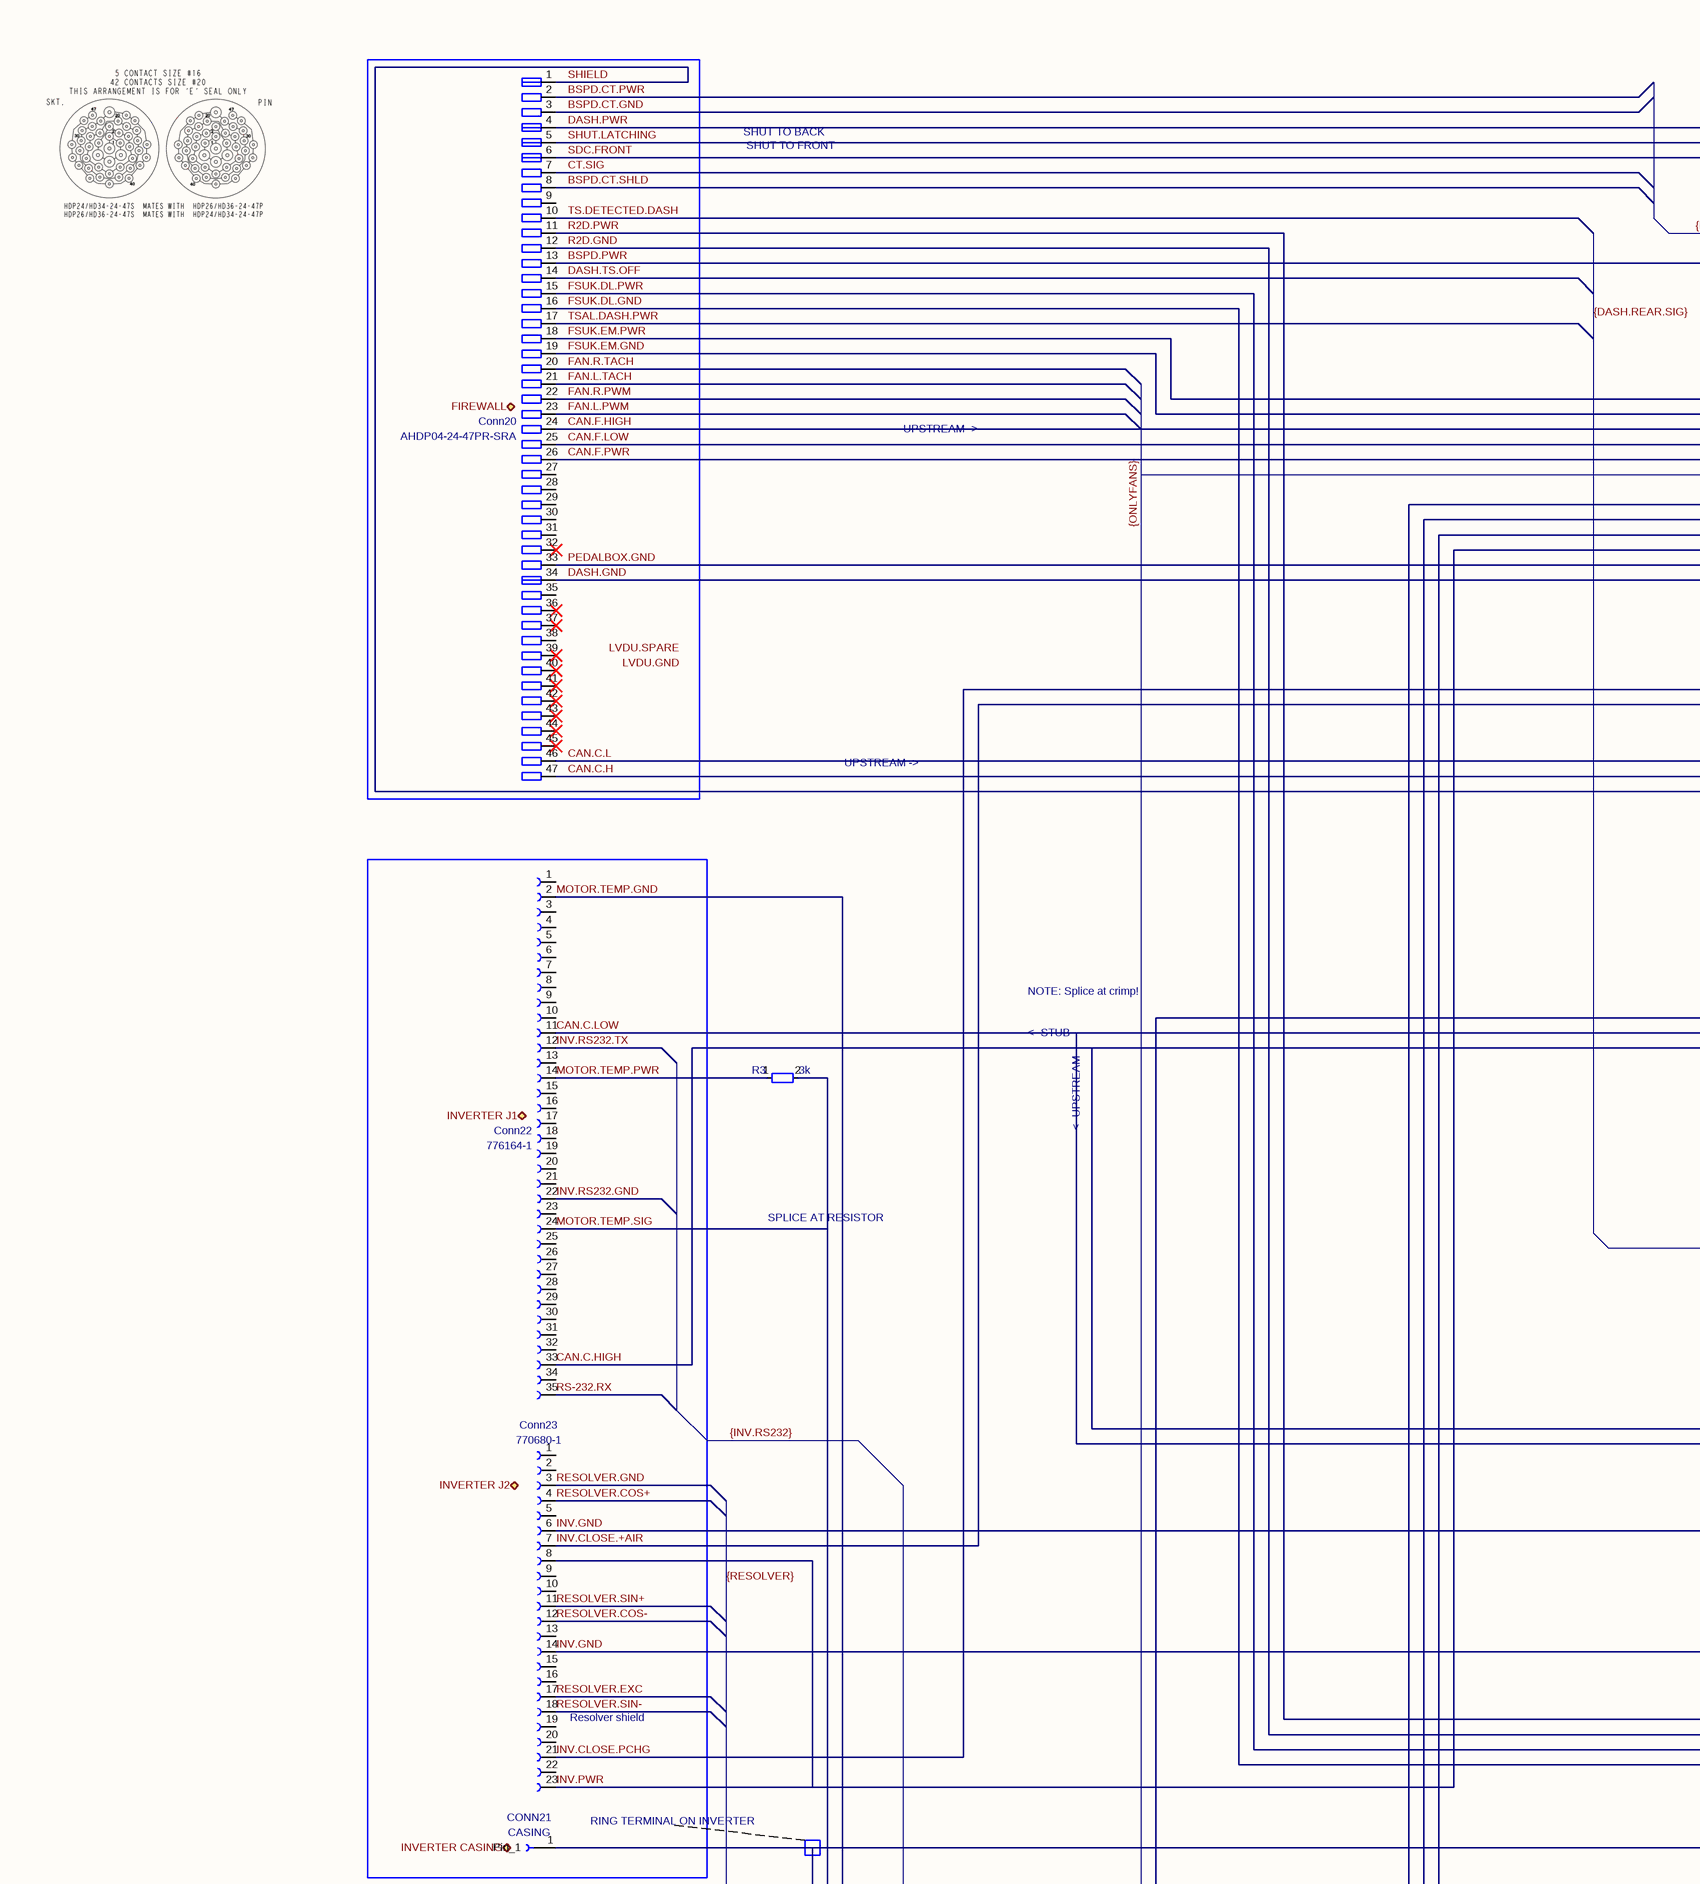
[diagram p34: loom-rear-new.SchDoc, top left]
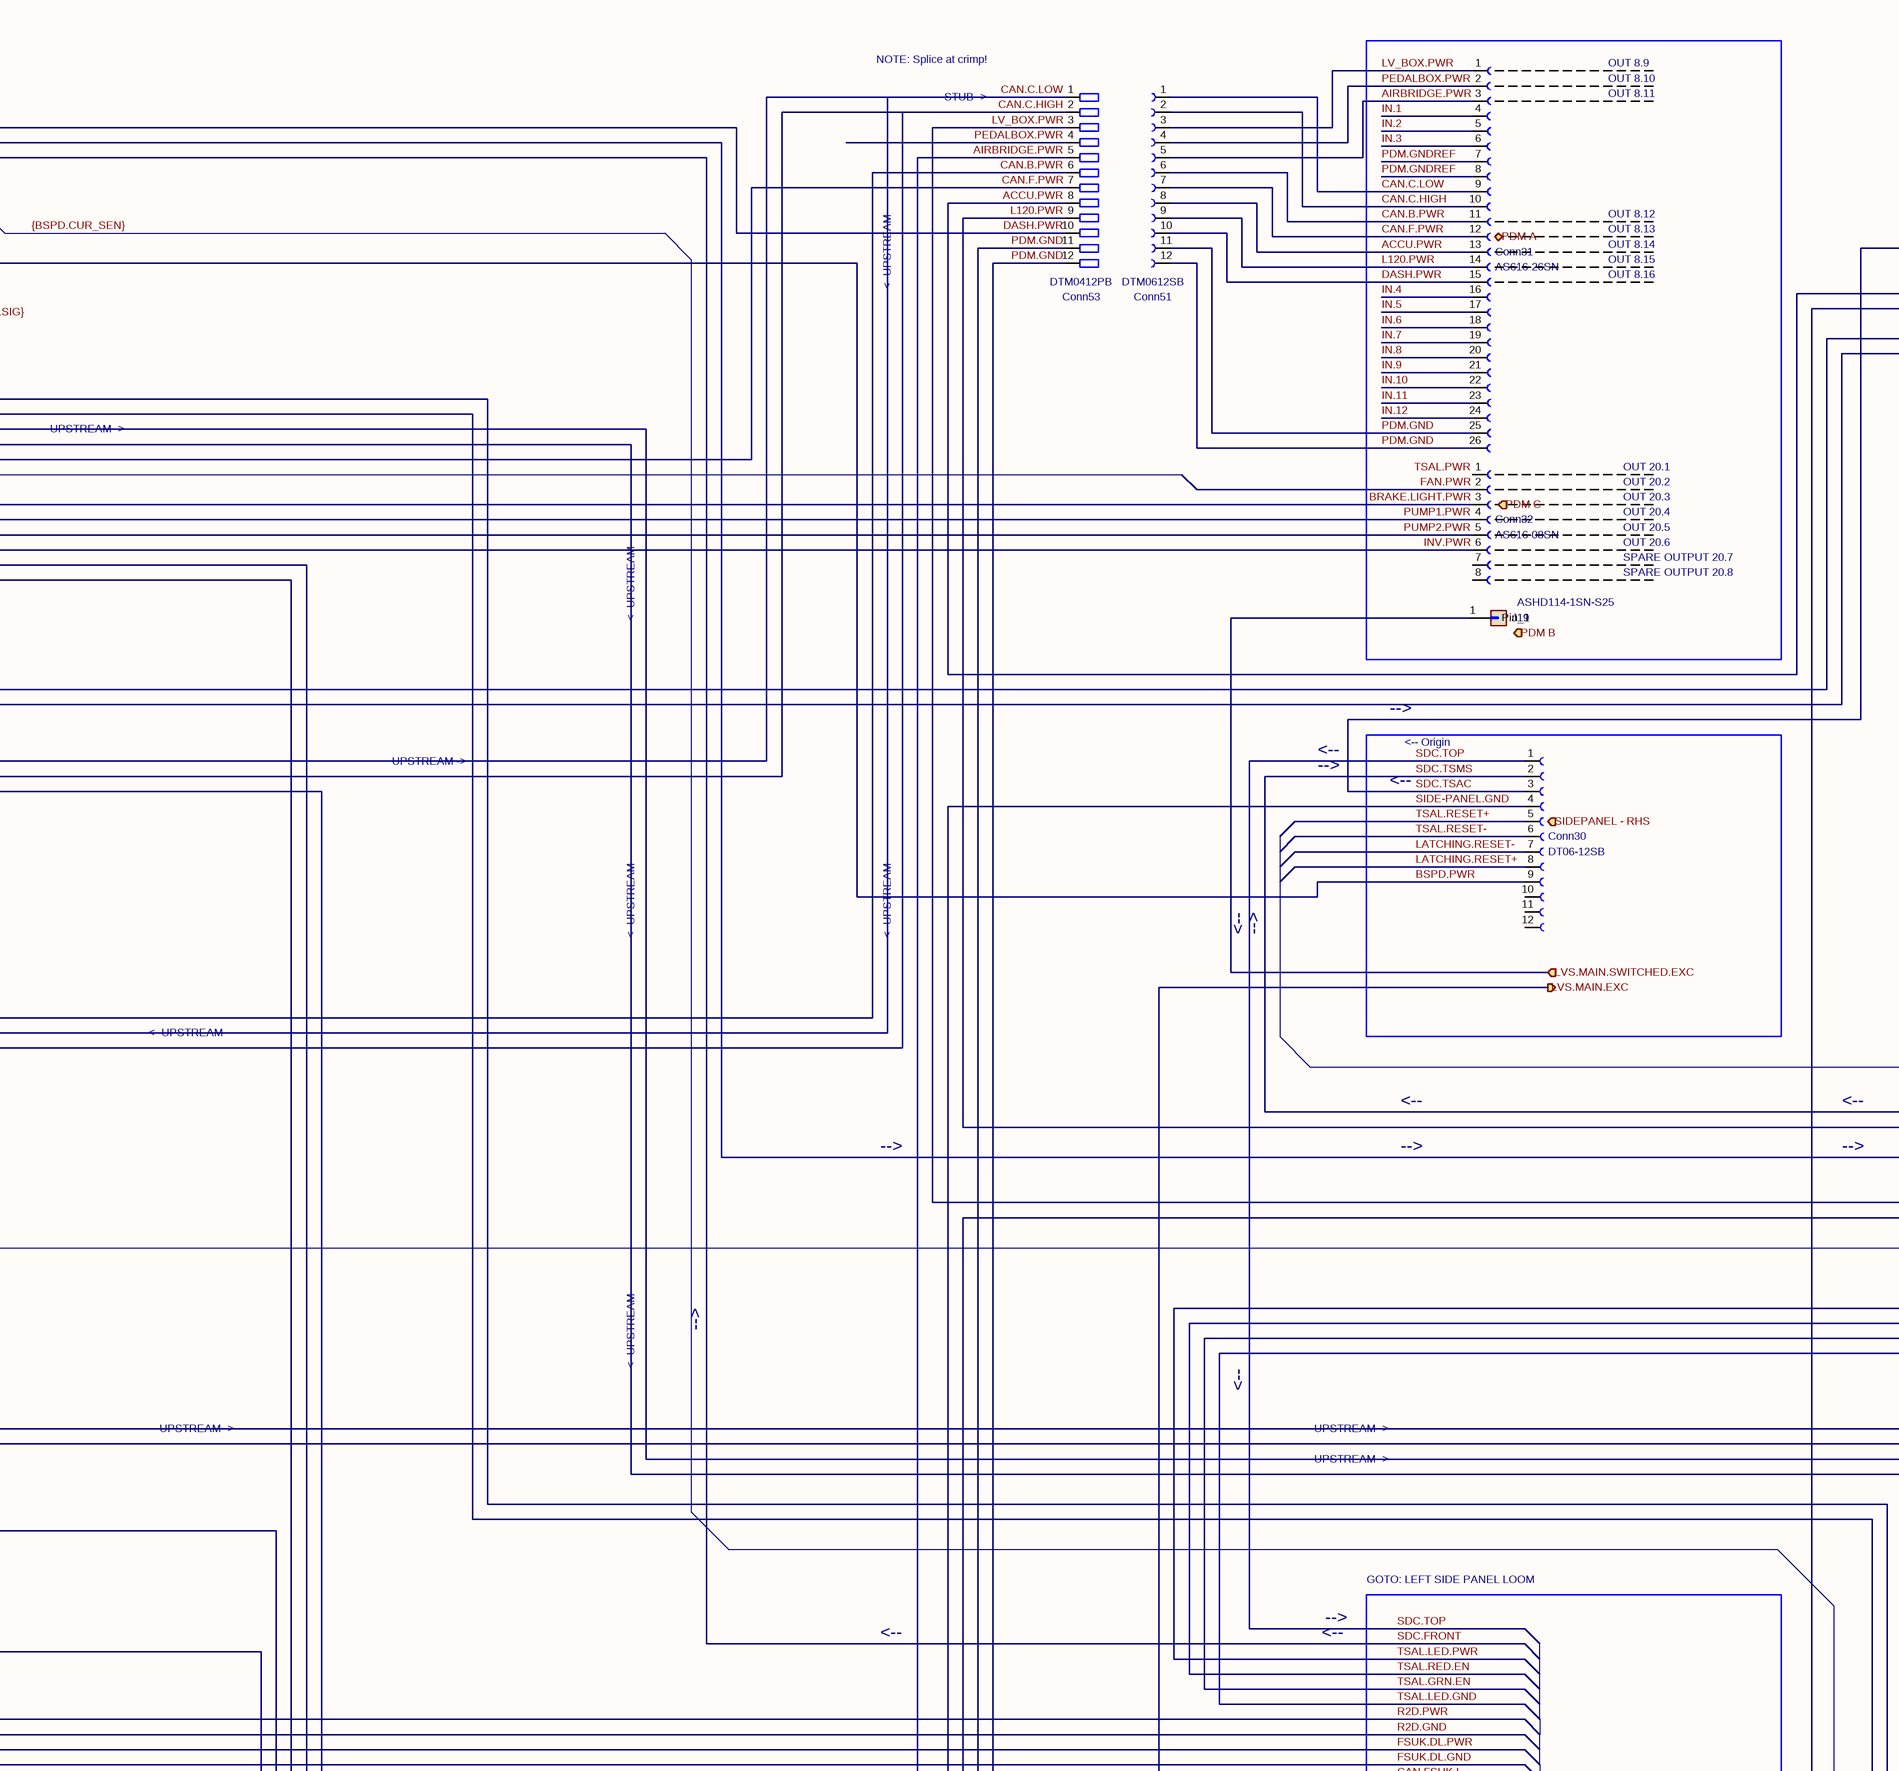
[diagram p35: loom-rear-new.SchDoc, top middle]
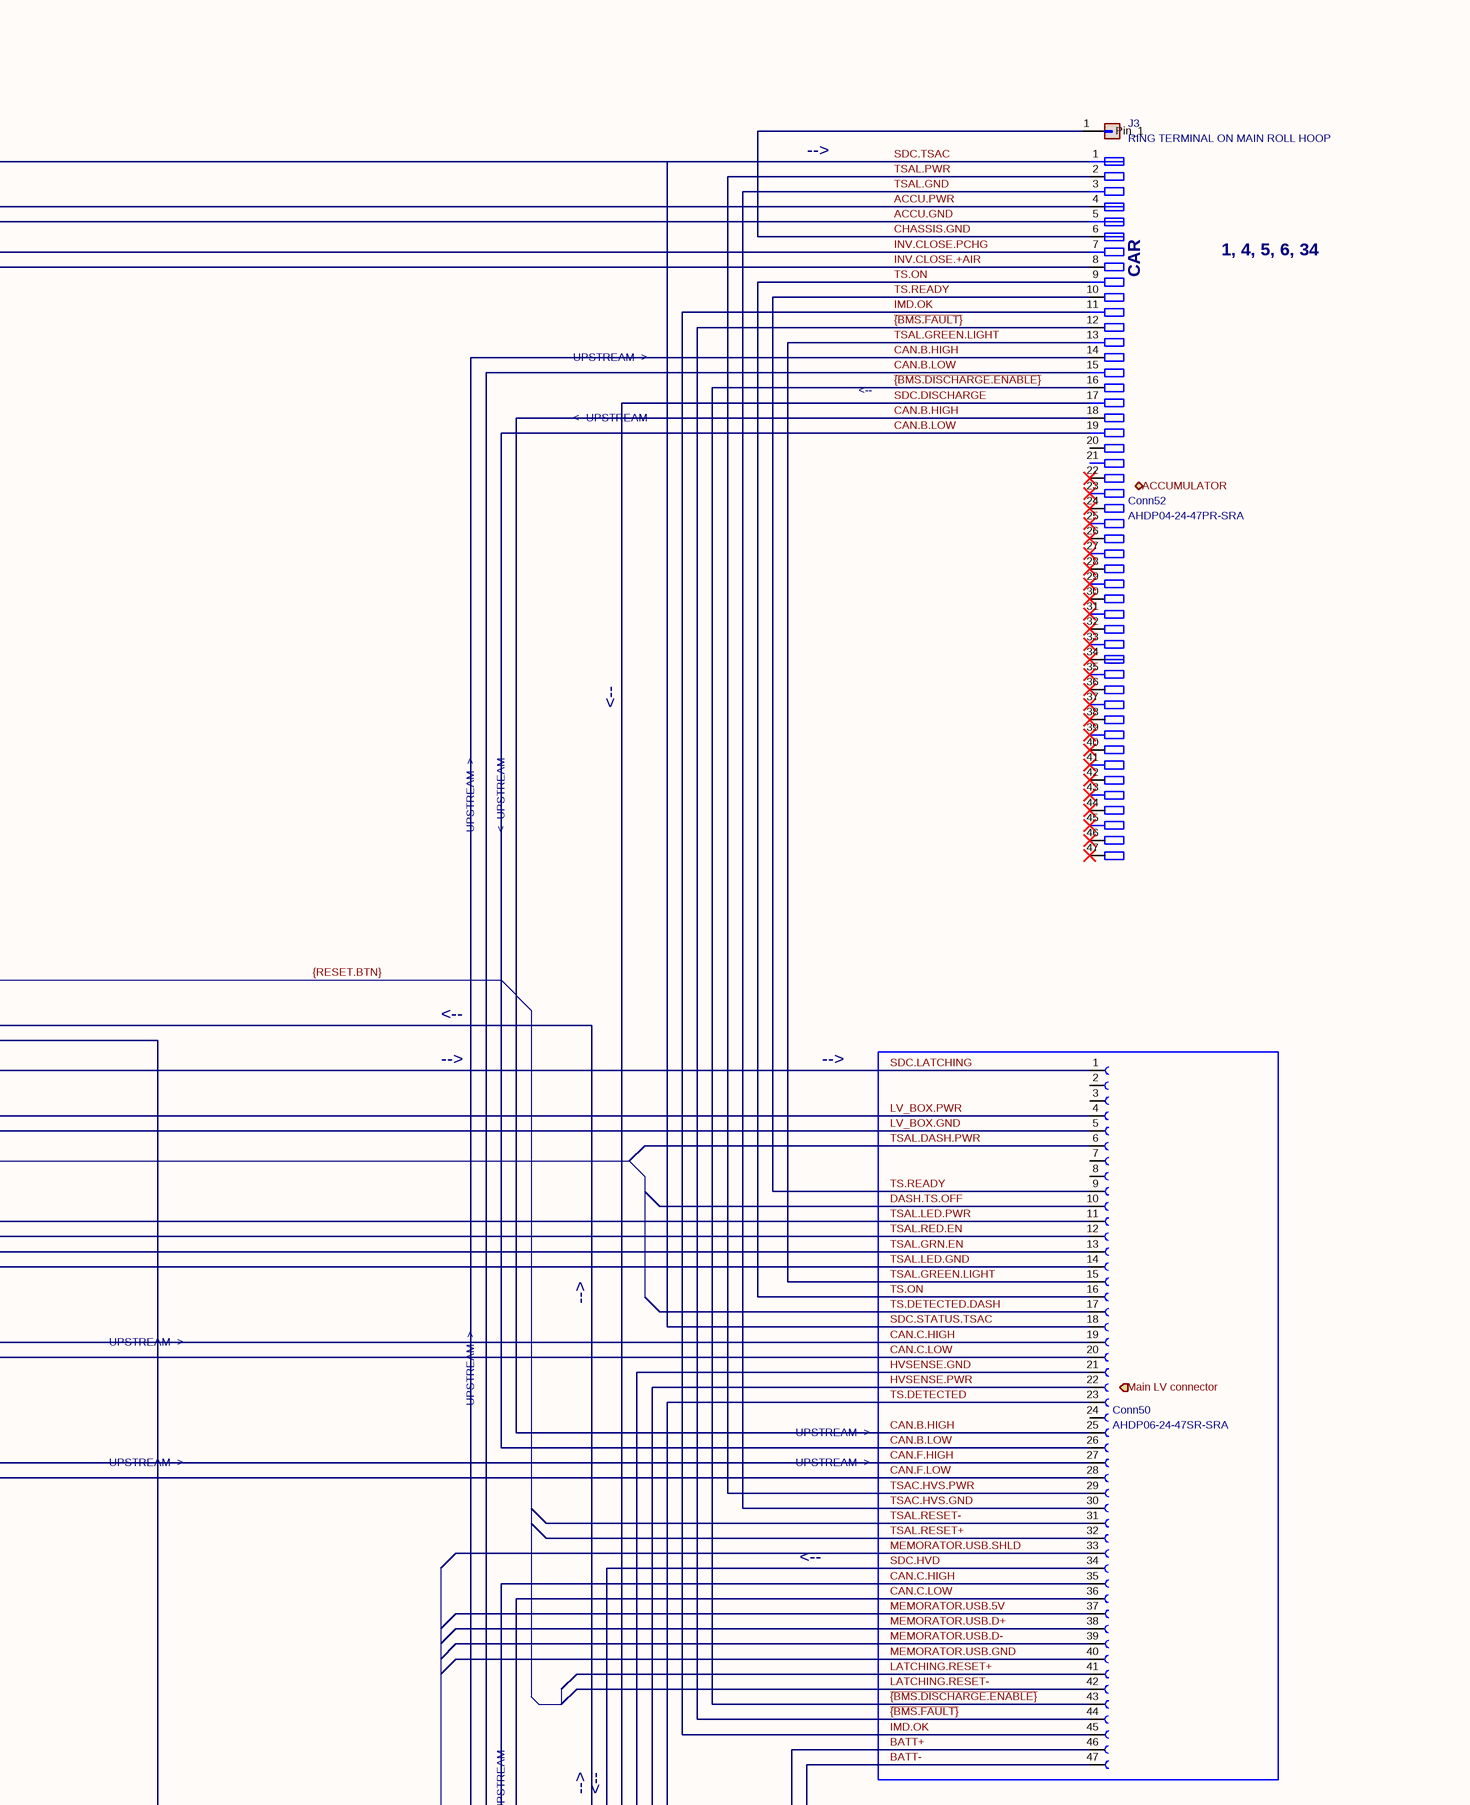
[diagram p36: loom-rear-new.SchDoc, top right]
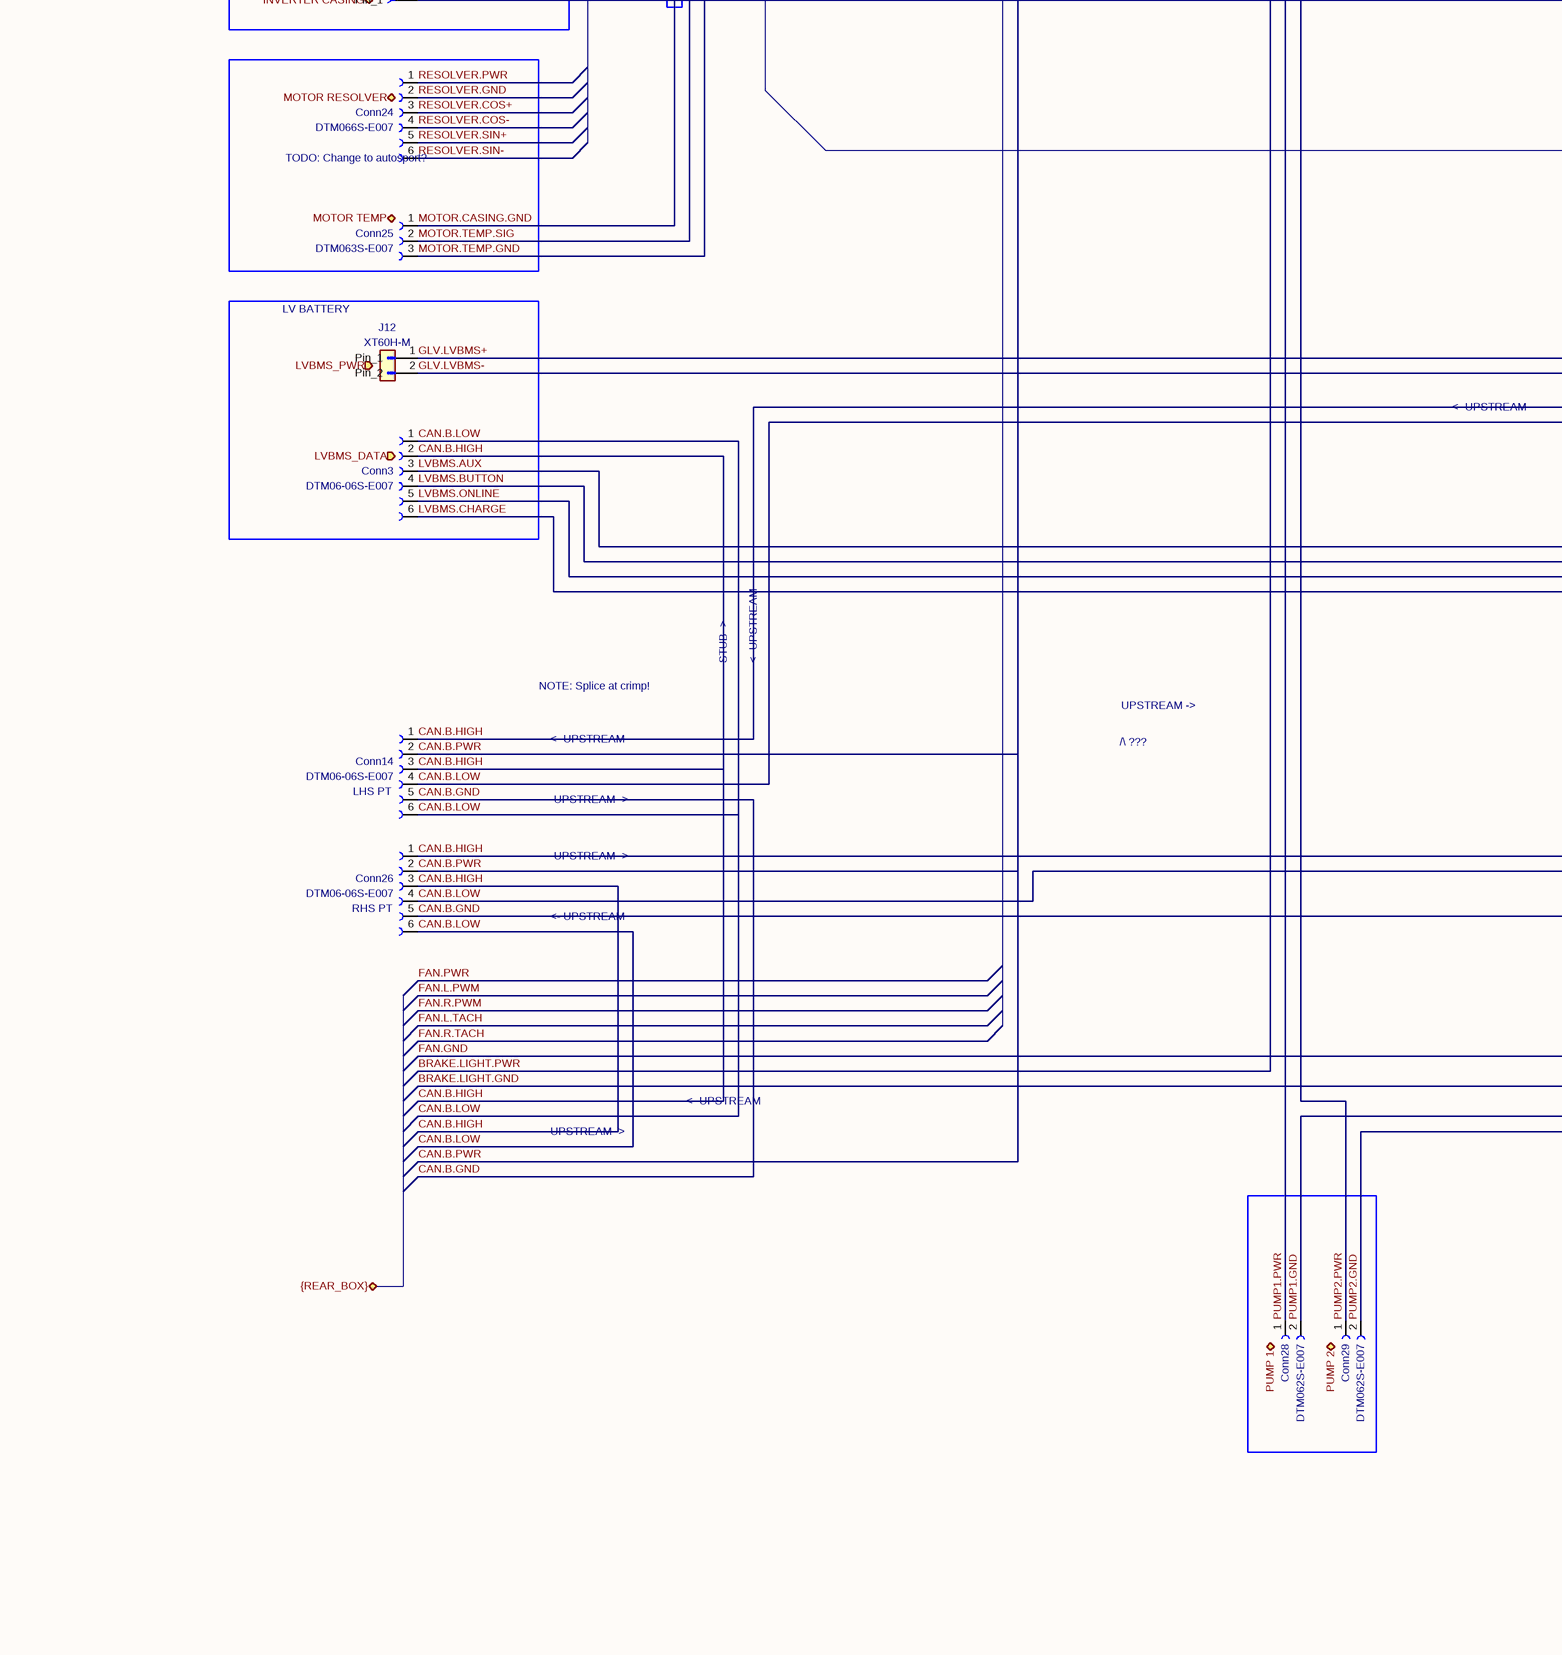
[diagram p37: loom-rear-new.SchDoc, bottom left]
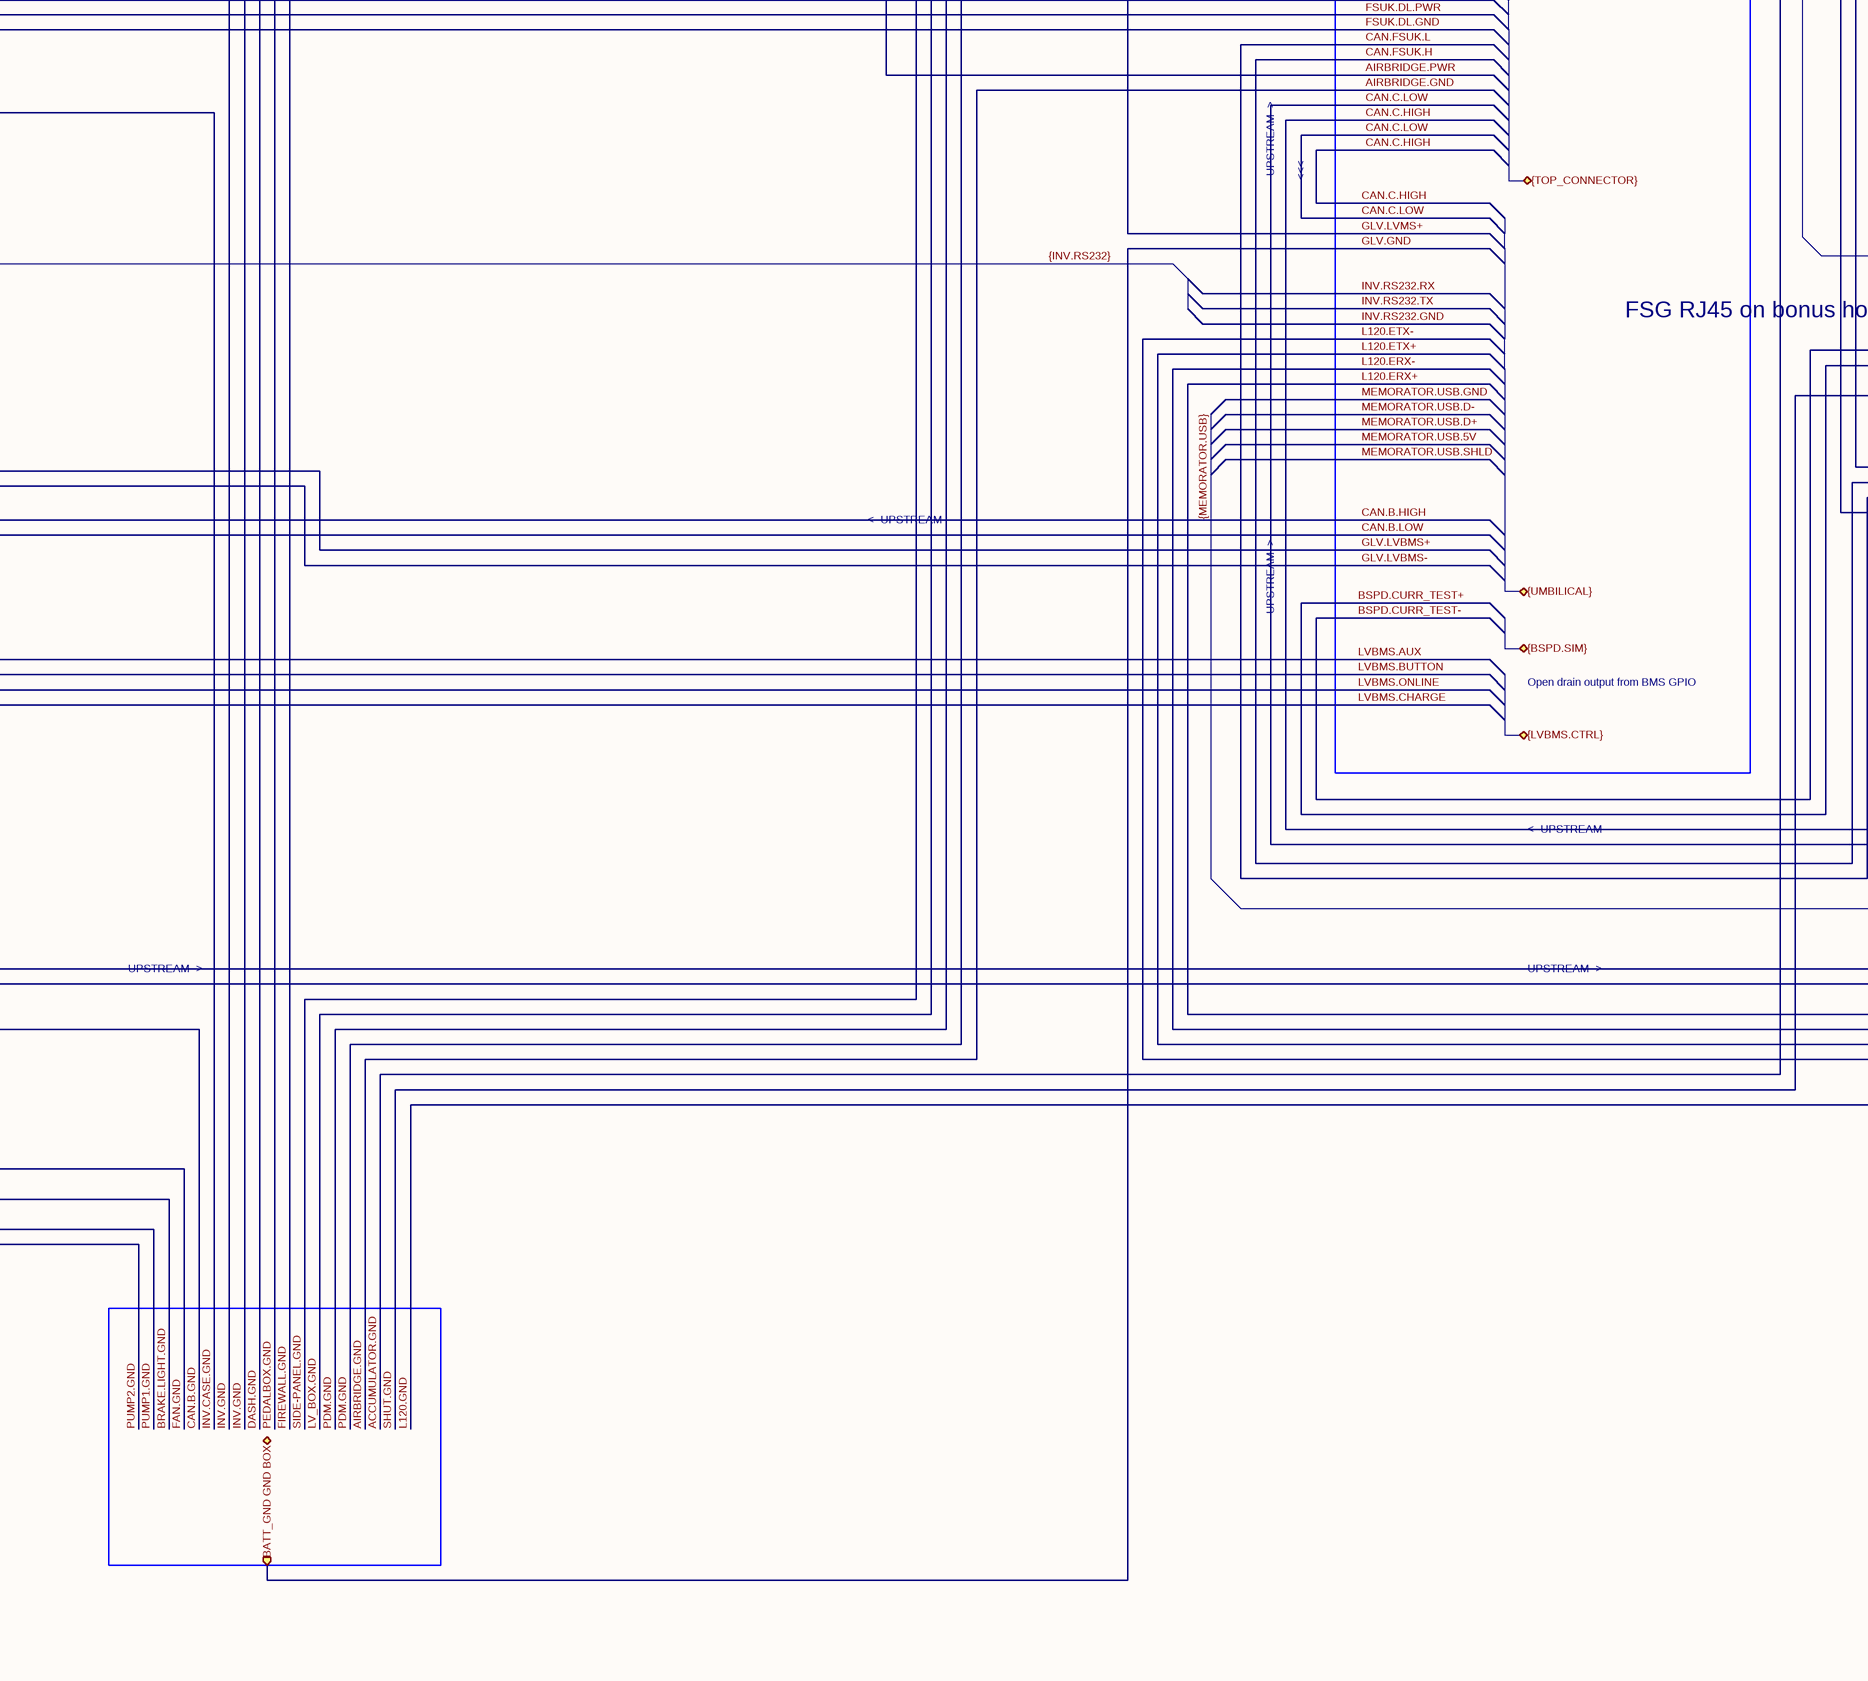
[diagram p38: loom-rear-new.SchDoc, bottom middle]
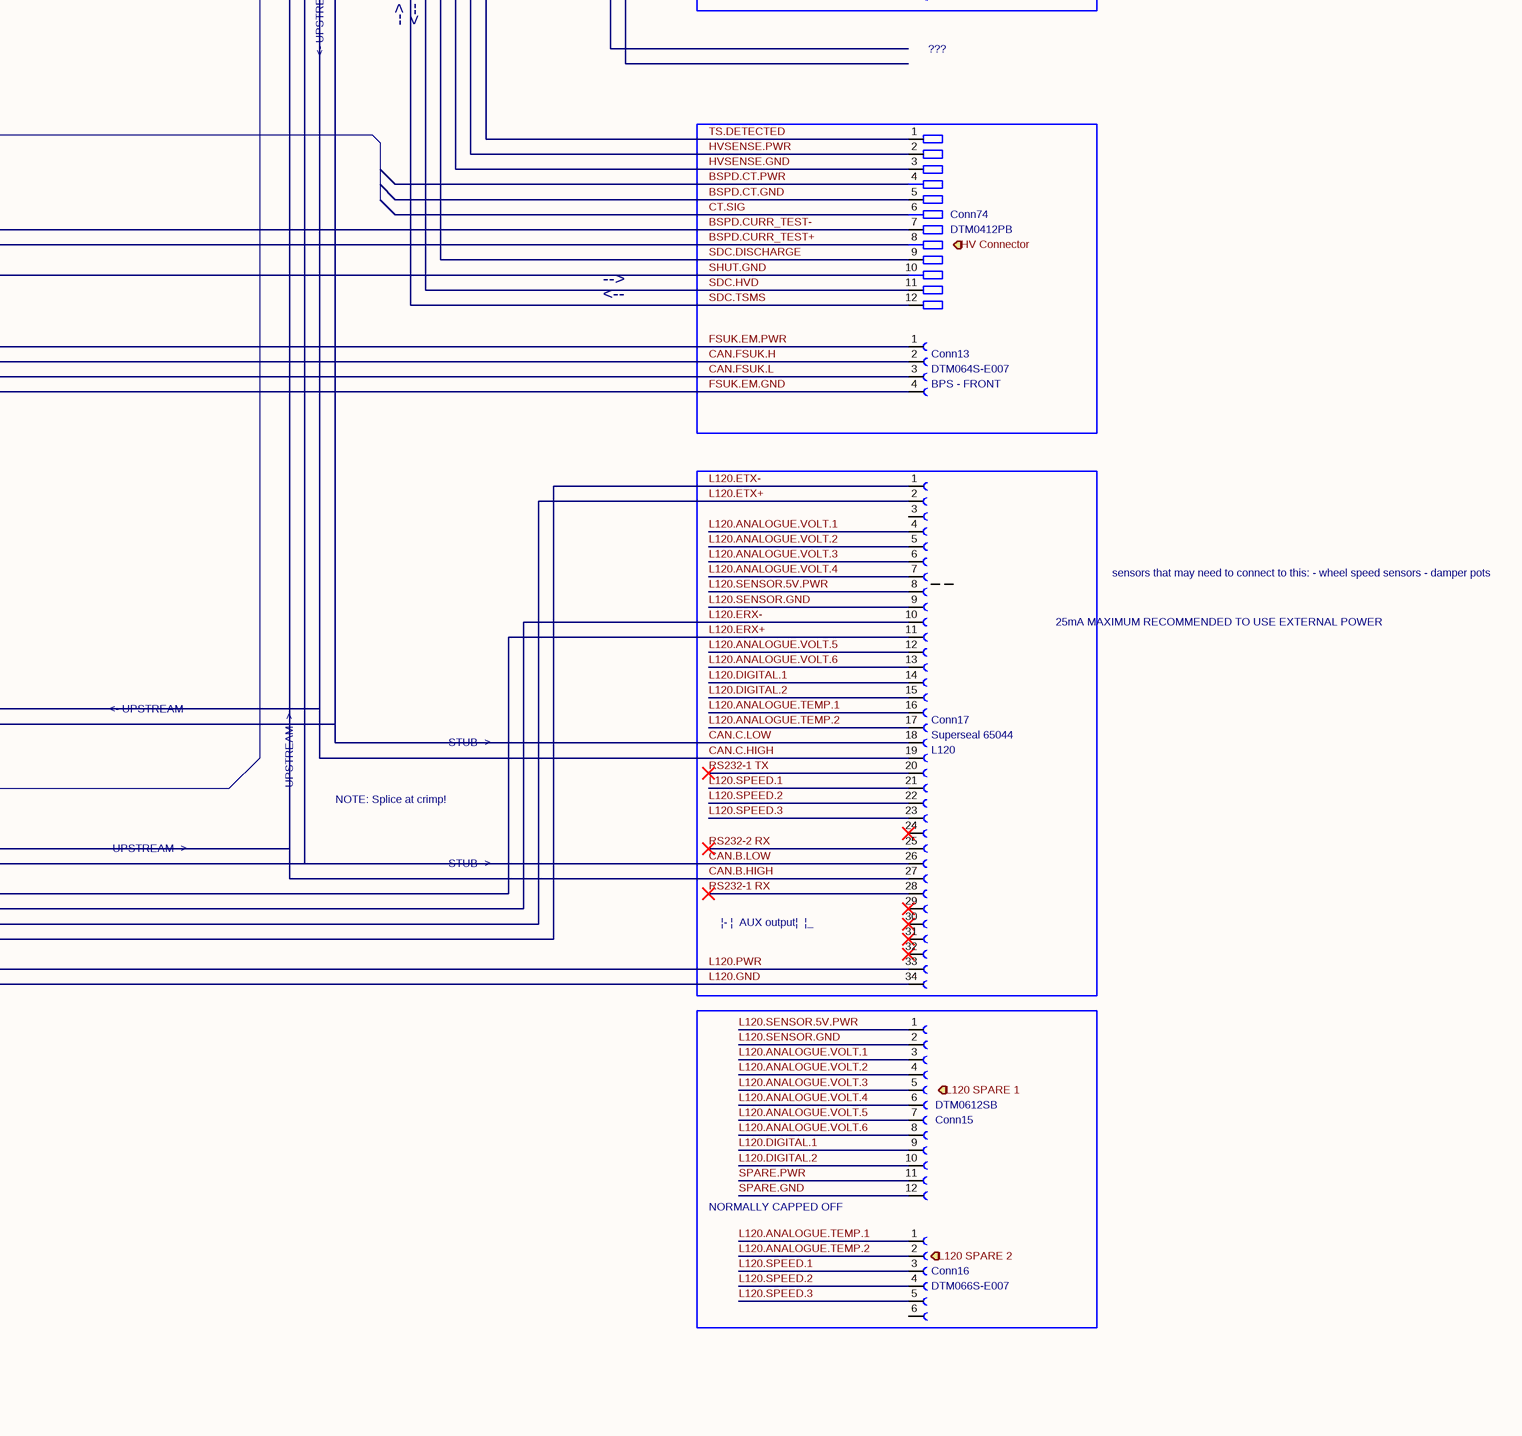
[diagram p39: loom-rear-new.SchDoc, bottom right]

### Parts
(Parts that share a designator on the sheet are numbered #1, #2 ... from top to bottom, then left to right.)
Conn3  P/N: DTM06-06S-E007  (hidden comment: Deutsch_DTM_6S_Pin)
Conn13  P/N: DTM064S-E007  Conn Name: BPS - FRONT  (hidden comment: Deutsch_DTM_4S_Pin)
Conn14  P/N: DTM06-06S-E007  Conn Name: LHS PT  (hidden comment: Deutsch_DTM_6S_Pin)
Conn15  P/N: DTM0612SB  (hidden comment: Deutsch_DTM_12S_Pin)
Conn16  P/N: DTM066S-E007  (hidden comment: Deutsch_DTM_6S_Pin)
Conn17  P/N: Superseal 65044  Conn Name: L120  (hidden comment: L120 Connector)
Conn20  P/N: AHDP04-24-47PR-SRA  (hidden comment: AMPHENOL-47P-Pannel)
CONN21  CASING
Conn22  P/N: 776164-1  (hidden comment: J1 Inverter Connector)
Conn23  P/N: 770680-1  (hidden comment: J2 Inverter Connector)
Conn24  P/N: DTM066S-E007  (hidden comment: Deutsch_DTM_6S_Pin)
Conn25  P/N: DTM063S-E007  (hidden comment: Deutsch_DTM_3S_Pin)
Conn26  P/N: DTM06-06S-E007  Conn Name: RHS PT  (hidden comment: Deutsch_DTM_6S_Pin)
Conn28  P/N: DTM062S-E007  (hidden comment: Deutsch_DTM_2S_Pin)
Conn29  P/N: DTM062S-E007  (hidden comment: Deutsch_DTM_2S_Pin)
Conn30  P/N: DT06-12SB  (hidden comment: Deutsch_DTM_12S_Pin)
Conn31  P/N: AS616-26SN  (hidden comment: Conn A PDM Connector)
Conn32  P/N: AS616-08SN  (hidden comment: Conn C PDM Connector)
Conn50  P/N: AHDP06-24-47SR-SRA  (hidden comment: AMPHENOL-47P-Recepticle)
Conn51  P/N: DTM0612SB  (hidden comment: Deutsch_DTM_12S_Pin)
Conn52  P/N: AHDP04-24-47PR-SRA  (hidden comment: AMPHENOL-47P-Pannel)
Conn53  P/N: DTM0412PB  (hidden comment: Deutsch_DTM_12P_Pin)
Conn74#2  P/N: DTM0412PB  (hidden comment: Deutsch_DTM_12P_Pin)
J3#1  RING TERMINAL ON MAIN ROLL HOOP
J12  XT60H-M
J19  ASHD114-1SN-S25
R3  3k

### Blocks framed on the sheet
TODO: Change to / autosport?: Conn24 Conn25
LV BATTERY: Conn3 J12
NORMALLY CAPPED OFF: Conn15 Conn16

### Ports
ACCUMULATOR (bidir), BATT_GND (in), FIREWALL (bidir), GND BOX (bidir), HV Connector (in), INVERTER CASING (bidir), INVERTER J1 (bidir), INVERTER J2 (bidir), L120 SPARE 1 (in), L120 SPARE 2 (in), LVBMS_DATA (in), LVBMS_PWR (in), LVS.MAIN.EXC (out), LVS.MAIN.SWITCHED.EXC (in), Main LV connector (in), MOTOR RESOLVER (bidir), MOTOR TEMP (bidir), PDM A (bidir), PDM B (out), PDM C (in), PUMP 1 (bidir), PUMP 2 (bidir), SIDEPANEL - RHS (in), {BSPD.SIM} (bidir), {LVBMS.CTRL} (bidir), {REAR_BOX} (bidir), {TOP_CONNECTOR} (bidir), {UMBILICAL} (bidir)

### Nets
ACCU.GND: Conn52.5  [also labelled ACCUMULATOR.GND]
ACCU.PWR: Conn31.13 Conn51.8 Conn52.4 Conn53.8
AIRBRIDGE.PWR: Conn31.3 Conn51.5 Conn53.5
BATT+: Conn50.46
BATT-: Conn50.47
BRAKE.LIGHT.PWR: Conn32.3
BSPD.CT.GND: Conn20.3 Conn74#2.5
BSPD.CT.PWR: Conn20.2 Conn74#2.4
BSPD.CT.SHLD: Conn20.8
BSPD.CURR_TEST+: Conn74#2.8
BSPD.CURR_TEST-: Conn74#2.7
BSPD.PWR: Conn20.13 Conn30.9
CAN.B.GND: Conn14.5 Conn26.5
CAN.B.HIGH: Conn3.2 Conn14.1 Conn14.3 Conn17.27 Conn26.1 Conn26.3 Conn50.25 Conn52.14 Conn52.18  [also labelled {MEMORATOR.USB}]
CAN.B.LOW: Conn3.1 Conn14.4 Conn14.6 Conn17.26 Conn26.4 Conn26.6 Conn50.26 Conn52.15 Conn52.19
CAN.B.PWR: Conn14.2 Conn26.2 Conn31.11 Conn51.6 Conn53.6
CAN.C.H: Conn17.19 Conn20.47 Conn22.33 Conn31.10 Conn50.19 Conn50.35 Conn51.2 Conn53.2  [also labelled CAN.C.HIGH]
CAN.C.L: Conn17.18 Conn20.46 Conn22.11 Conn31.9 Conn50.20 Conn50.36 Conn51.1 Conn53.1  [also labelled CAN.C.LOW]
CAN.F.HIGH: Conn20.23 Conn20.24 Conn50.27  [also labelled FAN.L.PWM]
CAN.F.LOW: Conn20.25 Conn50.28
CAN.F.PWR: Conn20.26 Conn31.12 Conn51.7 Conn53.7
CAN.FSUK.H: Conn13.2
CAN.FSUK.L: Conn13.3
CHASSIS.GND: Conn52.6 J3#1.1(Pin_1)
CT.SIG: Conn20.7 Conn74#2.6
DASH.GND: Conn20.34
DASH.PWR: Conn20.4 Conn31.15 Conn51.10 Conn53.10
DASH.TS.OFF: Conn20.14 Conn50.10
FAN.L.TACH: Conn20.21
FAN.PWR: Conn32.2
FAN.R.PWM: Conn20.22
FAN.R.TACH: Conn20.20
FIREWALL.GND: Conn20.1  [also labelled SHIELD]
FSUK.DL.GND: Conn20.16
FSUK.DL.PWR: Conn20.15
FSUK.EM.GND: Conn13.4 Conn20.19
FSUK.EM.PWR: Conn13.1 Conn20.18
GLV.GND: port BATT_GND
GLV.LVBMS+: J12.1(Pin_1)
GLV.LVBMS-: J12.2(Pin_2)
HVSENSE.GND: Conn50.21 Conn74#2.3
HVSENSE.PWR: Conn50.22 Conn74#2.2
IMD.OK: Conn50.45 Conn52.11
IN.1: Conn31.4
IN.2: Conn31.5
IN.3: Conn31.6
IN.4: Conn31.16
IN.5: Conn31.17
IN.6: Conn31.18
IN.7: Conn31.19
IN.8: Conn31.20
IN.9: Conn31.21
IN.10: Conn31.22
IN.11: Conn31.23
IN.12: Conn31.24
INV.CASE.GND: CONN21.1(Pin_1) Conn25.1  [also labelled MOTOR.CASING.GND]
INV.CLOSE.+AIR: Conn23.7 Conn52.8
INV.CLOSE.PCHG: Conn23.21 Conn52.7
INV.GND: Conn23.6 Conn23.14
INV.PWR: Conn23.8 Conn23.23 Conn32.6
INV.RS232.GND: Conn22.22
INV.RS232.TX: Conn22.12
L120.ANALOGUE.TEMP.1: Conn16.1 Conn17.16
L120.ANALOGUE.TEMP.2: Conn16.2 Conn17.17
L120.ANALOGUE.VOLT.1: Conn15.3 Conn17.4
L120.ANALOGUE.VOLT.2: Conn15.4 Conn17.5
L120.ANALOGUE.VOLT.3: Conn15.5 Conn17.6
L120.ANALOGUE.VOLT.4: Conn15.6 Conn17.7
L120.ANALOGUE.VOLT.5: Conn15.7 Conn17.12
L120.ANALOGUE.VOLT.6: Conn15.8 Conn17.13
L120.DIGITAL.1: Conn15.9 Conn17.14
L120.DIGITAL.2: Conn15.10 Conn17.15
L120.ERX+: Conn17.11
L120.ERX-: Conn17.10
L120.ETX+: Conn17.2
L120.ETX-: Conn17.1
L120.GND: Conn17.34
L120.PWR: Conn17.33 Conn31.14 Conn51.9 Conn53.9
L120.SENSOR.5V.PWR: Conn15.1 Conn17.8
L120.SENSOR.GND: Conn15.2 Conn17.9
L120.SPEED.1: Conn16.3 Conn17.21
L120.SPEED.2: Conn16.4 Conn17.22
L120.SPEED.3: Conn16.5 Conn17.23
LATCHING.RESET+: Conn30.8 Conn50.41
LATCHING.RESET-: Conn30.7 Conn50.42
LV_BOX.GND: Conn50.5
LV_BOX.PWR: Conn31.1 Conn50.4 Conn51.3 Conn53.3
LVBMS.AUX: Conn3.3
LVBMS.BUTTON: Conn3.4
LVBMS.CHARGE: Conn3.6
LVBMS.ONLINE: Conn3.5
LVS.MAIN.SWITCHED.EXC: J19.1(Pin_1) ; port LVS.MAIN.SWITCHED.EXC
MEMORATOR.USB.5V: Conn50.37
MEMORATOR.USB.D+: Conn50.38
MEMORATOR.USB.D-: Conn50.39
MEMORATOR.USB.GND: Conn50.40
MEMORATOR.USB.SHLD: Conn50.33
MOTOR.TEMP.GND: Conn22.2 Conn25.3
MOTOR.TEMP.PWR: Conn22.14 R3.1
MOTOR.TEMP.SIG: Conn22.24 Conn25.2 R3.2
PDM.GND: Conn31.25 Conn31.26 Conn51.11 Conn51.12 Conn53.11 Conn53.12
PDM.GNDREF: Conn31.7 Conn31.8
PEDALBOX.GND: Conn20.33
PEDALBOX.PWR: Conn31.2 Conn51.4 Conn53.4
PUMP1.GND: Conn28.2
PUMP1.PWR: Conn28.1 Conn32.4
PUMP2.GND: Conn29.2
PUMP2.PWR: Conn29.1 Conn32.5
R2D.GND: Conn20.12
R2D.PWR: Conn20.11
RESOLVER.COS+: Conn23.4 Conn24.3
RESOLVER.COS-: Conn23.12 Conn24.4
RESOLVER.EXC: Conn23.17
RESOLVER.GND: Conn23.3 Conn24.2
RESOLVER.PWR: Conn24.1
RESOLVER.SIN+: Conn23.11 Conn24.5
RESOLVER.SIN-: Conn23.18 Conn24.6
RS232-1 RX: Conn17.28
RS232-1 TX: Conn17.20
RS232-2 RX: Conn17.25
RS-232.RX: Conn22.35
SDC.DISCHARGE: Conn52.17 Conn74#2.9
SDC.FRONT: Conn20.6
SDC.HVD: Conn50.34 Conn74#2.11
SDC.LATCHING: Conn20.5 Conn50.1  [also labelled SHUT.LATCHING]
SDC.STATUS.TSAC: Conn30.3 Conn50.18 Conn52.1  [also labelled SDC.TSAC]
SDC.TOP: Conn30.1
SDC.TSMS: Conn30.2 Conn74#2.12
SHUT.GND: Conn74#2.10
SIDE-PANEL.GND: Conn30.4
SPARE.GND: Conn15.12
SPARE.PWR: Conn15.11
TS.DETECTED: Conn50.23 Conn74#2.1
TS.DETECTED.DASH: Conn20.10 Conn50.17
TS.ON: Conn50.16 Conn52.9
TS.READY: Conn50.9 Conn52.10
TSAC.HVS.GND: Conn50.30 Conn52.3  [also labelled TSAL.GND]
TSAC.HVS.PWR: Conn32.1 Conn50.29 Conn52.2  [also labelled TSAL.PWR]
TSAL.DASH.PWR: Conn20.17 Conn50.6
TSAL.GREEN.LIGHT: Conn50.15 Conn52.13
TSAL.GRN.EN: Conn50.13
TSAL.LED.GND: Conn50.14
TSAL.LED.PWR: Conn50.11
TSAL.RED.EN: Conn50.12
TSAL.RESET+: Conn30.5 Conn50.32
TSAL.RESET-: Conn30.6 Conn50.31
~{{BMS.DISCHARGE.ENABLE}}: Conn50.43 Conn52.16
~{{BMS.FAULT}}: Conn50.44 Conn52.12

Not connected (* = marked no-connect by the designer): Conn16 6; Conn17 3 24* 29* 30* 31* 32*; Conn20 9 27 28 29 30 31 32* 35 36* 37* 38 39* 40* 41* 42* 43* 44* 45*; Conn22 1 3 4 5 6 7 8 9 10 13 15 16 17 18 19 20 21 23 25 26 27 28 29 30 31 32 34; Conn23 1 2 5 9 10 13 15 16 19 20 22; Conn30 10 11 12; Conn32 7 8; Conn50 2 3 7 8 24; Conn52 20 21 22* 23* 24* 25* 26* 27* 28* 29* 30* 31* 32* 33* 34* 35* 36* 37* 38* 39* 40* 41* 42* 43* 44* 45* 46* 47*

### Buses and harness runs
bus {BSPD.CUR_SEN}
bus {DASH.REAR.SIG}
bus {INV.RS232}
bus {ONLYFANS}
bus {RESET.BTN}
bus {RESOLVER}

### Notes on the sheet
- NOTE: Splice
  at crimp!
- OUT 8.10
- OUT 8.9
- OUT 8.11
- SHUT TO BACK
- SHUT TO FRONT
- STUB ->
- OUT 8.12
- OUT 8.14
- OUT 8.13
- -->
- <- UPSTREAM
- OUT 8.15
- OUT 8.16
- (near Conn52) CAR
- 1, 4, 5, 6, 34
- UPSTREAM ->
- OUT 20.1
- OUT 20.5
- OUT 20.2
- OUT 20.3
- OUT 20.4
- OUT 20.6
- <--
- SPARE OUTPUT 20.8
- SPARE OUTPUT 20.7
- <-- Origin
- <- STUB
- SPLICE AT
  RESISTOR
- GOTO: LEFT SIDE PANEL LOOM
- (near Conn23) Resolver shield
- RING TERMINAL
  ON INVERTER
- (near Conn50) ???
- <<<
- FSG RJ45
  on bonus hole
- Open drain
  output from BMS
  GPIO
- sensors that may need to connect to this:
  - wheel speed sensors
  - damper pots
- 25mA MAXIMUM
  RECOMMENDED
  TO USE EXTERNAL
  POWER
- /\
  ???
- |-
  |
  AUX output|
  |_
- Labels drawn without touching a wire or pin: LVDU.GND, LVDU.SPARE
- 1
- 2
- 3
- 4
- 5
- 6
- 7
- 8
- 9
- 10
- 11
- 12
- 13
- 14
- 15
- 16
- A
- B
- C
- D
- E
- F
- G
- H
- I
- J
- K
- Title:  Rear Loom
- File: loom-rear-new.kicad_sch
- Sheet: /
- KiCad E.D.A.  kicad (5.1.4)-1
- Size: A1
- Date: 2025-11-29
- Rev: 1.0
- Id: 1/1

### Library data of the parts
CONN21 = Conn_01x01_Socket: Value: CASING
J3#1 = Conn_01x01: Value: RING TERMINAL ON MAIN ROLL HOOP
J12 = Conn_01x02: Description: Generic connector, single row, 01x02, script generated (kicad-library-utils/schlib/autogen/connector/); Value: XT60H-M
J19 = Conn_01x01: Description: Generic connector, single row, 01x01, script generated (kicad-library-utils/schlib/autogen/connector/); Value: ASHD114-1SN-S25
R3 = R_Small: Value: 3k
Conn3 Conn14 Conn16 Conn24 Conn26 = Deutsch_DTM_6S_Pin: Value: Deutsch_DTM_6S_Pin
Conn13 = Deutsch_DTM_4S_Pin: Value: Deutsch_DTM_4S_Pin
Conn15 Conn30 Conn51 = Deutsch_DTM_12S_Pin: Value: Deutsch_DTM_12S_Pin
Conn17 = L120 Connector: Value: L120 Connector
Conn20 Conn52 = AMPHENOL-47P-Pannel: Value: AMPHENOL-47P-Pannel
Conn22 = J1 Inverter Connector: Value: J1 Inverter Connector
Conn23 = J2 Inverter Connector: Value: J2 Inverter Connector
Conn25 = Deutsch_DTM_3S_Pin: Value: Deutsch_DTM_3S_Pin
Conn28 Conn29 = Deutsch_DTM_2S_Pin: Value: Deutsch_DTM_2S_Pin
Conn31 = Conn A PDM Connector: Value: Conn A PDM Connector
Conn32 = Conn C PDM Connector: Value: Conn C PDM Connector
Conn50 = AMPHENOL-47P-Recepticle: Value: AMPHENOL-47P-Recepticle
Conn53 Conn74#2 = Deutsch_DTM_12P_Pin: Value: Deutsch_DTM_12P_Pin

## Sheet loom-charging-cart.SchDoc
size 297 x 209 mm
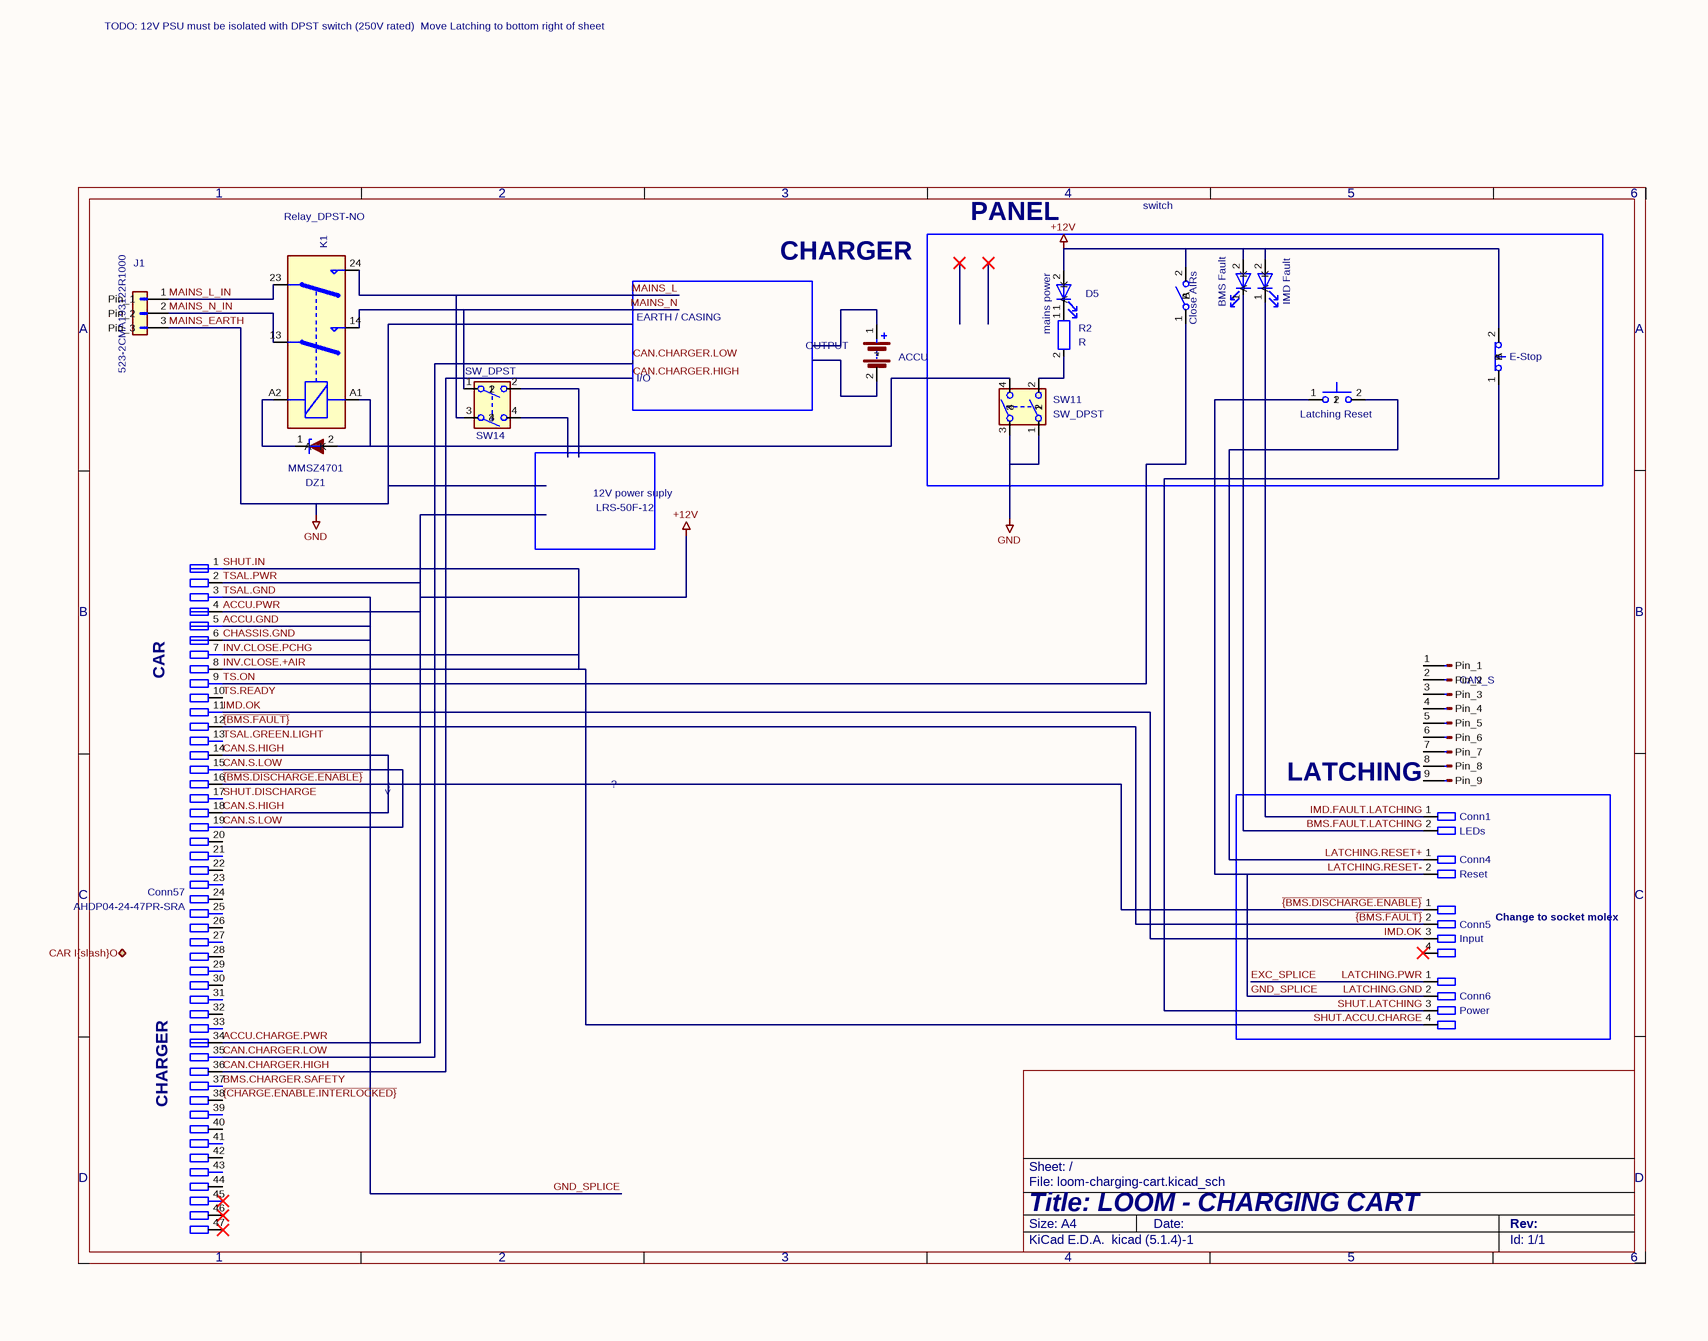
[diagram p40: loom-charging-cart.SchDoc]

### Parts
BT1  ACCU
Conn1  Name: LEDs  (hidden comment: Molex_2x1P_Horizontal_THT)
Conn4  Name: Reset  (hidden comment: Molex_2x1P_Horizontal_THT)
Conn5  Name: Input  (hidden comment: Molex_2x2P_Horizontal)
Conn6  Name: Power  (hidden comment: Molex_2x2P_Horizontal)
Conn57  P/N: AHDP04-24-47PR-SRA  (hidden comment: AMPHENOL-47P-Pannel)
D1  IMD Fault
D2  BMS Fault
D5  mains power
DZ1  MMSZ4701  [D_SOD-123]
J1  523-2CMA193122R1000
J2  CAN_S
K1  Relay_DPST-NO
R2  R
SW1  E-Stop
SW2  Latching Reset
SW3  Close AIRs
SW11  SW_DPST
SW14  SW_DPST

### Blocks framed on the sheet
PANEL: D1 D2 D5 R2 SW1-SW3 SW11
LATCHING: Conn1 Conn4-Conn6

### Ports
CAR I{slash}O (bidir)

### Nets
ACCU.CHARGE.PWR: Conn57.2 Conn57.4 Conn57.34 D1.2(A) D2.2(A) D5.2(A) SW1.2(B) SW3.2(B)  [also labelled +12V, ACCU.PWR, TSAL.PWR]
GND: J1.3(Pin_3) SW11.1 SW11.3  [also labelled MAINS_EARTH]  [project net +AIR.AUX.GND]
ACCU.GND: Conn4.2 Conn6.2 Conn57.3 Conn57.5 Conn57.6 SW2.1  [also labelled CHASSIS.GND, GND_SPLICE, LATCHING.GND, LATCHING.RESET-, TSAL.GND]
BMS.CHARGER.SAFETY: Conn57.37
BMS.FAULT.LATCHING: Conn1.2 D2.1(K)
CAN.CHARGER.HIGH: Conn57.36
CAN.CHARGER.LOW: Conn57.35
CAN.S.HIGH: Conn57.14 Conn57.18
CAN.S.LOW: Conn57.15 Conn57.19
EXC_SPLICE: Conn6.1  [also labelled LATCHING.PWR]
IMD.FAULT.LATCHING: Conn1.1 D1.1(K)
IMD.OK: Conn5.3 Conn57.11
INV.CLOSE.+AIR: Conn6.4 Conn57.1 Conn57.7 Conn57.8  [also labelled INV.CLOSE.PCHG, SHUT.ACCU.CHARGE, SHUT.IN]
LATCHING.RESET+: Conn4.1 SW2.2
MAINS_L: K1.24 SW14.3
MAINS_L_IN: J1.1(Pin_1) K1.23
MAINS_N: K1.14 SW14.1
MAINS_N_IN: J1.2(Pin_2) K1.13
SHUT.DISCHARGE: Conn57.17
SHUT.LATCHING: Conn6.3 SW1.1(A)
TS.ON: Conn57.9 SW3.1(A)
TS.READY: Conn57.10
TSAL.GREEN.LIGHT: Conn57.13
~{{BMS.DISCHARGE.ENABLE}}: Conn5.1 Conn57.16
~{{BMS.FAULT}}: Conn5.2 Conn57.12
~{{CHARGE.ENABLE.INTERLOCKED}}: Conn57.38
NetD5_1: D5.1(K) R2.1
NetDZ1_1: DZ1.1(K) K1.A2
NetDZ1_2: DZ1.2(A) K1.A1 SW11.4
NetR2_2: R2.2 SW11.2

Not connected (* = marked no-connect by the designer): BT1 1(+) 2(-); Conn5 4*; Conn57 20 21 22 23 24 25 26 27 28 29 30 31 32 33 39 40 41 42 43 44 45* 46* 47*; J2 1(Pin_1) 2(Pin_2) 3(Pin_3) 4(Pin_4) 5(Pin_5) 6(Pin_6) 7(Pin_7) 8(Pin_8) 9(Pin_9); SW14 2 4

### Notes on the sheet
- TODO:
  12V PSU must be isolated with
  DPST switch (250V rated)
  Move Latching to bottom right
  of sheet
- CHARGER
- switch
- EARTH / CASING
- I/O
- (near BT1) OUTPUT
- 12V power suply
- LRS-50F-12
- (near Conn57) CAR
- <--
- ?
- Change to socket molex
- (near Conn57) CHARGER
- 1
- 2
- 3
- 4
- 5
- 6
- A
- B
- C
- D
- Title: LOOM - CHARGING CART
- File: loom-charging-cart.kicad_sch
- Sheet: /
- KiCad E.D.A.  kicad (5.1.4)-1
- Size: A4
- Date:
- Rev:
- Id: 1/1

### Library data of the parts
BT1 = Battery: Description: Multiple-cell battery; Value: ACCU
Conn1 Conn4 = Molex_2x1P_Horizontal_THT: P/N: 43650-0200; Value: Molex_2x1P_Horizontal_THT
Conn5 Conn6 = Molex_2x2P_Horizontal: P/N: 43045-0400; Value: Molex_2x2P_Horizontal
D1 D2 = LED: Description: Light emitting diode
  D1: Value: IMD Fault
  D2: Value: BMS Fault
D5 = LED_1: Description: Light emitting diode; Sim.Pins: 1=K 2=A; Value: mains power
DZ1 = MMSZ4701: Description: SOD-123 Zener diode, 14V, 500mW, Alternate KiCAD Library; Value: MMSZ4701; Footprint: PCM_Diode_SMD_AKL:D_SOD-123
J1 = Conn_01x03: Description: Generic connector, single row, 01x03, script generated (kicad-library-utils/schlib/autogen/connector/); Value: 523-2CMA193122R1000
J2 = Conn_01x09_Pin: Description: Generic connector, single row, 01x09, script generated; Value: CAN_S
K1 = Relay_DPST-NO: Description: Monostable Relay DPST, Normally Open, EN50005; Value: Relay_DPST-NO
R2 = R: Description: Resistor; Value: R
SW1 = SW_Push_Open: Value: E-Stop
SW2 = SW_Push: Description: Push button switch, generic, two pins; Value: Latching Reset
SW3 = SW_SPST: Description: Single Pole Single Throw (SPST) switch; Value: Close AIRs
SW11 SW14 = SW_DPST: Description: Double Pole Single Throw (DPST) Switch; Value: SW_DPST
Conn57 = AMPHENOL-47P-Pannel: Value: AMPHENOL-47P-Pannel

## Sheet device-sagl.SchDoc
size 297 x 209 mm
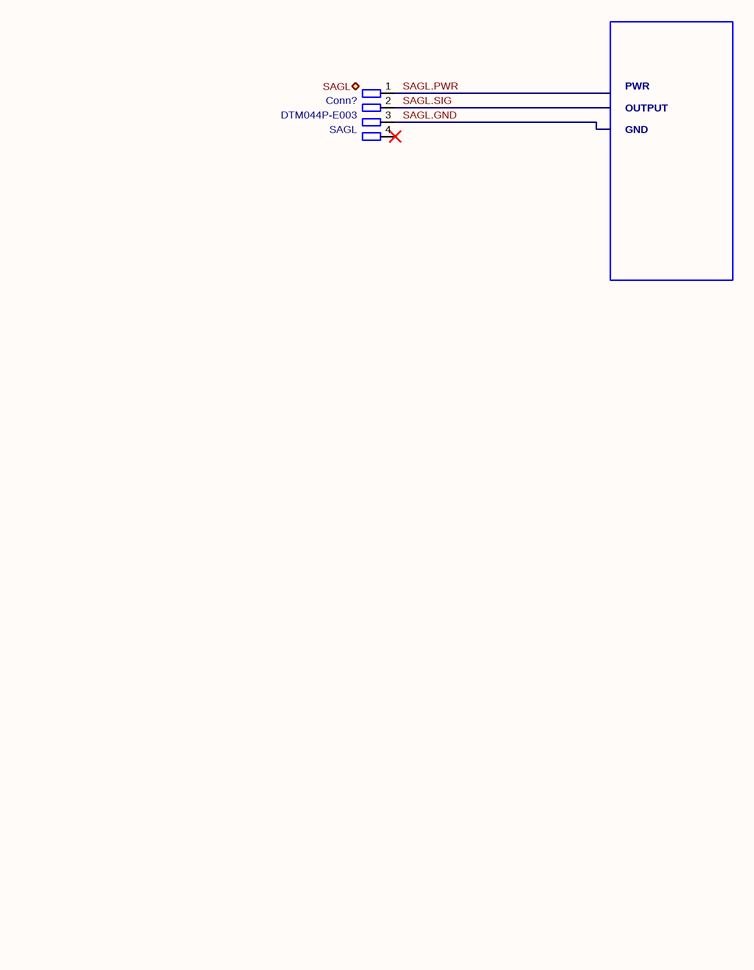
[diagram p41: device-sagl.SchDoc]

### Parts
(Parts that share a designator on the sheet are numbered #1, #2 ... from top to bottom, then left to right.)
Conn?#13  P/N: DTM044P-E003  Conn Name: SAGL  (hidden comment: Deutsch_DTM_4S_Pin)

### Ports
SAGL (bidir)

### Nets
SAGL.GND: Conn?#13.3
SAGL.PWR: Conn?#13.1
SAGL.SIG: Conn?#13.2

Not connected (* = marked no-connect by the designer): Conn?#13 4*

### Notes on the sheet
- OUTPUT
- PWR
- GND
- 1
- 2
- 3
- 4
- 5
- 6
- A
- B
- C
- D
- Title: DEVICE - SAGL
- File: device-sagl.kicad_sch
- Sheet: /
- KiCad E.D.A.  kicad (5.1.4)-1
- Size: A4
- Date:
- Rev:
- Id: 1/1

### Library data of the parts
Conn?#13 = Deutsch_DTM_4P_Pin: Value: Deutsch_DTM_4S_Pin

## Sheet device-vcu.SchDoc
size 297 x 209 mm
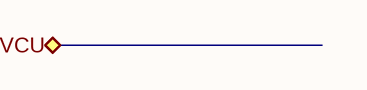
[diagram p42: device-vcu.SchDoc]

### Ports
VCU (bidir)

### Notes on the sheet
- 1
- 2
- 3
- 4
- 5
- 6
- A
- B
- C
- D
- Title:
- File: device-vcu.kicad_sch
- Sheet: /
- KiCad E.D.A.  kicad (5.1.4)-1
- Size: A4
- Date:
- Rev:
- Id: 1/1

## Sheet device-r2ds.SchDoc
size 297 x 209 mm
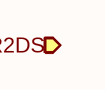
[diagram p43: device-r2ds.SchDoc]

### Ports
R2DS (in)

### Notes on the sheet
- 1
- 2
- 3
- 4
- 5
- 6
- A
- B
- C
- D
- Title:
- File: device-r2ds.kicad_sch
- Sheet: /
- KiCad E.D.A.  kicad (5.1.4)-1
- Size: A4
- Date:
- Rev:
- Id: 1/1